# EAGLE design main_board (EAGLE 9.3.0)
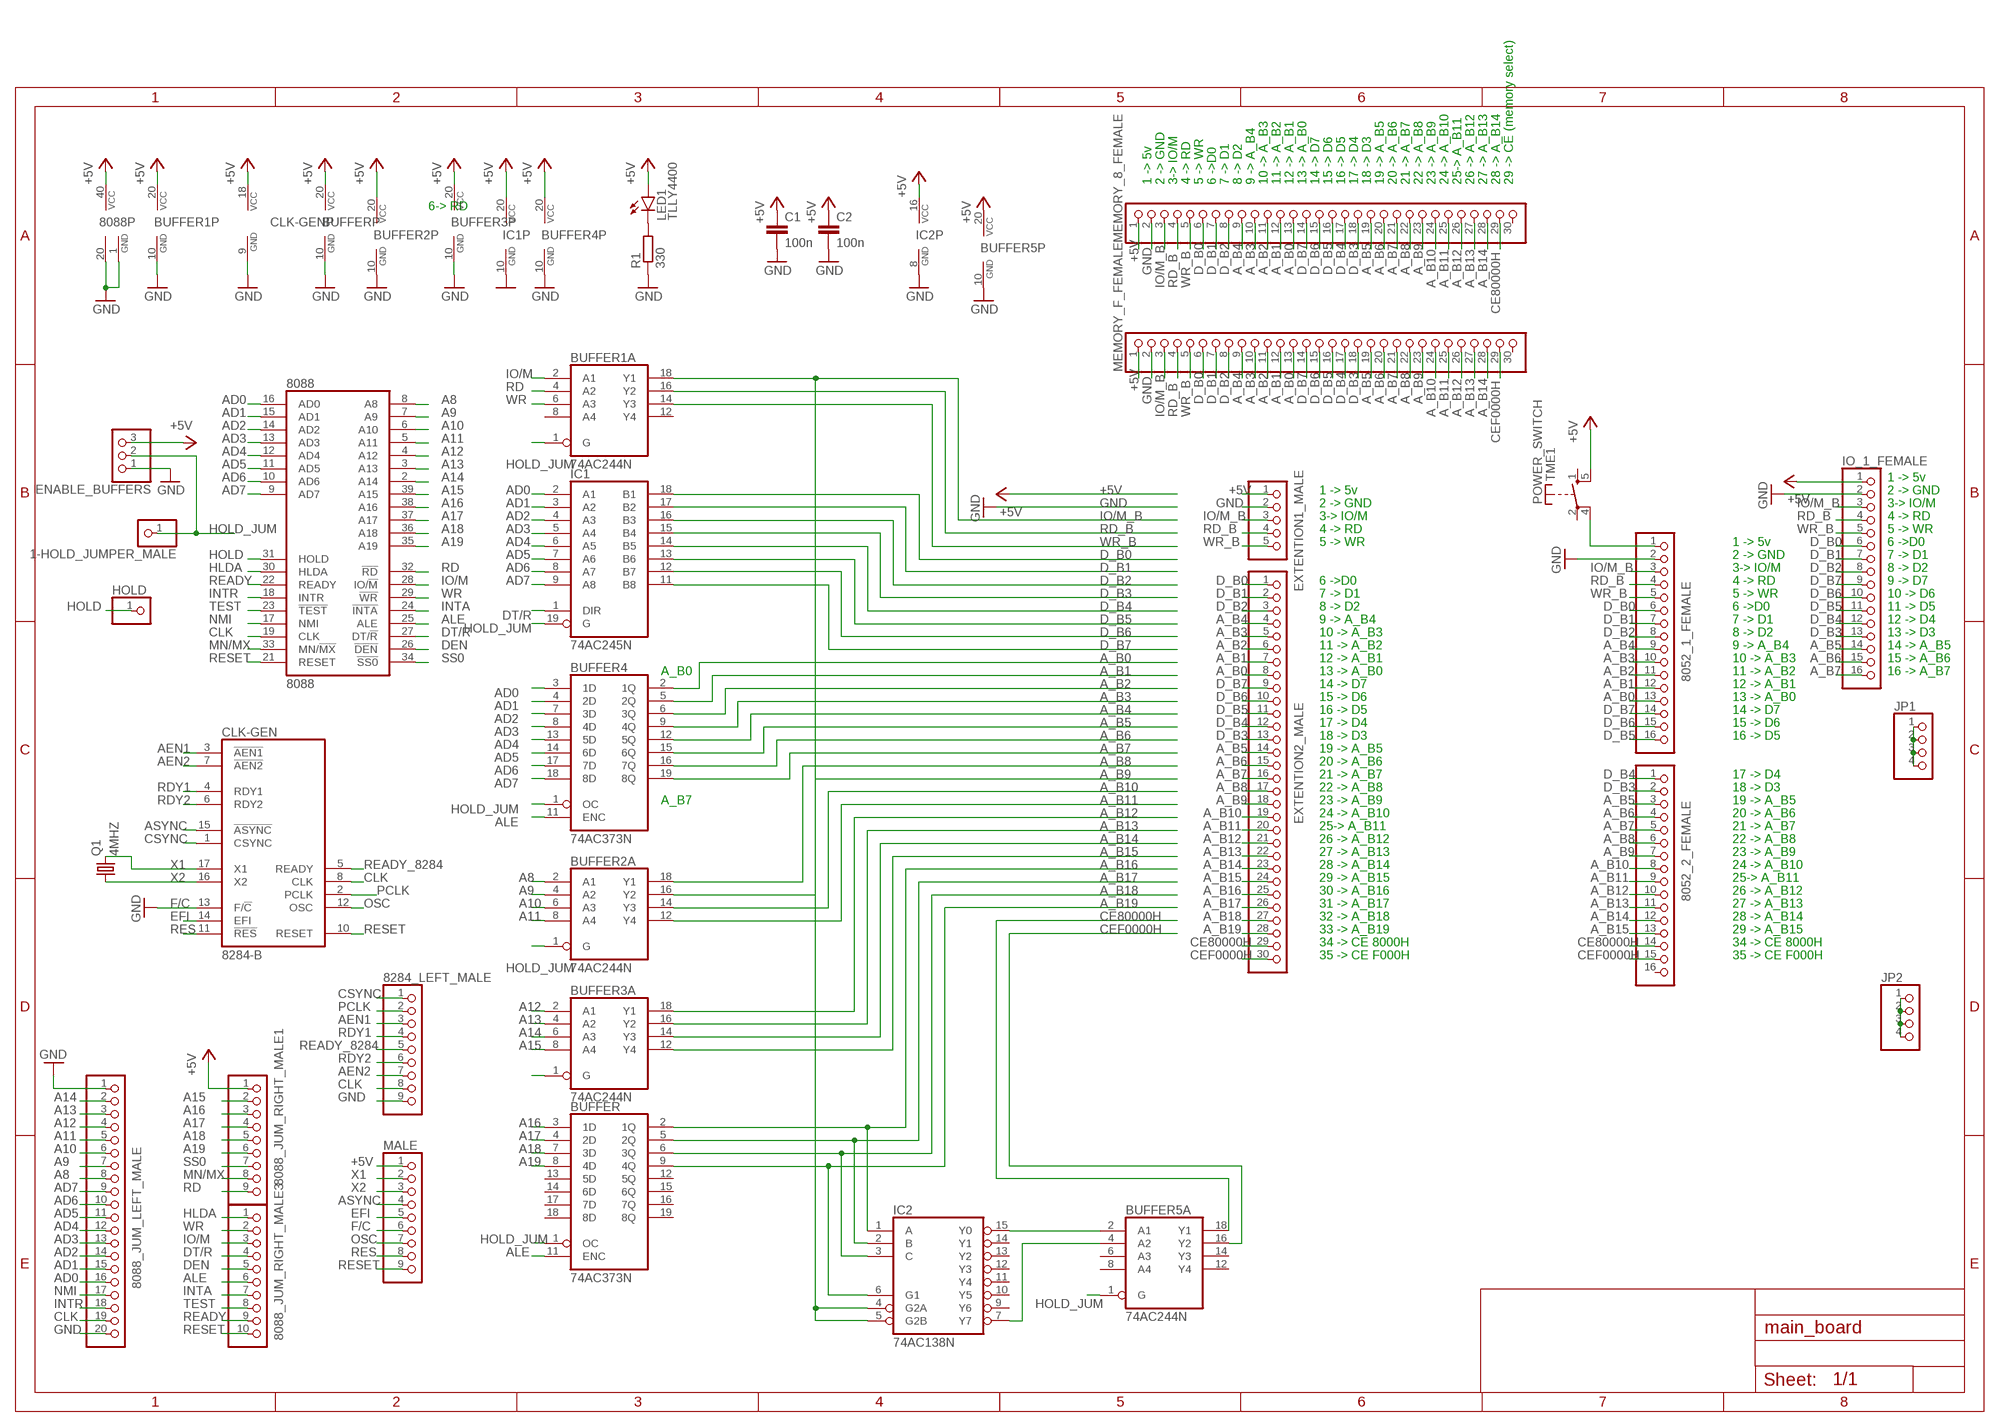
[diagram p0: schematic, sheet 1]

## Parts
1-HOLD_JUMPER_MALE  PINHD-1X1  [1X01]
8052_1_FEMALE  PINHD-1X16  [1X16]
8052_2_FEMALE  PINHD-1X16  [1X16]
8088  8088  [DIL40]
8088_JUM_LEFT_MALE  PINHD-1X20  [1X20]
8088_JUM_RIGHT_MALE1  PINHD-1X9  [1X09]
8088_JUM_RIGHT_MALE3  PINHD-1X10  [1X10]
8284_LEFT_MALE  PINHD-1X9  [1X09]
BUFFER  74AC373N  [DIL20]
BUFFER1  74AC244N  [DIL20]
BUFFER2  74AC244N  [DIL20]
BUFFER3  74AC244N  [DIL20]
BUFFER4  74AC373N  [DIL20]
BUFFER5  74AC244N  [DIL20]
C1  100n  C-EU025-025X050  [C025-025X050]
C2  100n  C-EU025-025X050  [C025-025X050]
CLK-GEN  8284-B  [DIL18]
ENABLE_BUFFERS  PINHD-1X3  [1X03]
EXTENTION1_MALE  PINHD-1X5  [1X05]
EXTENTION2_MALE  PINHD-1X30  [1X30]
HOLD  PINHD-1X1  [1X01]
IC1  74AC245N  [DIL20]
IC2  74AC138N  [DIL16]
IO_1_FEMALE  PINHD-1X16  [1X16]
JP1  PINHD-1X4  [1X04]
JP2  PINHD-1X4  [1X04]
LED1  TLLY4400  [LED3MM]
MALE  PINHD-1X9  [1X09]
MEMORY_8_FEMALE  PINHD-1X30  [1X30]
MEMORY_F_FEMALE  PINHD-1X30  [1X30]
POWER_SWITCH  TME1  [TME1]
Q1  4MHZ  CRYSTALHC49S  [HC49/S]
R1  330  R-EU_0204/5  [0204/5]

## Nets
+5V: 8088.40(VCC) 8088_JUM_RIGHT_MALE1.1 BUFFER1.20(P:VCC) BUFFER2.20(P:VCC) BUFFER3.20(P:VCC) BUFFER4.20(VCC) BUFFER5.20(P:VCC) BUFFER.20(VCC) C1.1 C2.1 CLK-GEN.18(VCC) ENABLE_BUFFERS.3 EXTENTION1_MALE.1 IC1.20(VCC) IC2.16(VCC) IO_1_FEMALE.1 LED1.A MALE.1 MEMORY_8_FEMALE.1 MEMORY_F_FEMALE.1 POWER_SWITCH.5(S)
A8: 8088.8(A8) 8088_JUM_LEFT_MALE.8 BUFFER2.2(A:A1)
A9: 8088.7(A9) 8088_JUM_LEFT_MALE.7 BUFFER2.4(A:A2)
A10: 8088.6(A10) 8088_JUM_LEFT_MALE.6 BUFFER2.6(A:A3)
A11: 8088.5(A11) 8088_JUM_LEFT_MALE.5 BUFFER2.8(A:A4)
A12: 8088.4(A12) 8088_JUM_LEFT_MALE.4 BUFFER3.2(A:A1)
A13: 8088.3(A13) 8088_JUM_LEFT_MALE.3 BUFFER3.4(A:A2)
A14: 8088.2(A14) 8088_JUM_LEFT_MALE.2 BUFFER3.6(A:A3)
A15: 8088.39(A15) 8088_JUM_RIGHT_MALE1.2 BUFFER3.8(A:A4)
A16: 8088.38(A16) 8088_JUM_RIGHT_MALE1.3 BUFFER.3(1D)
A17: 8088.37(A17) 8088_JUM_RIGHT_MALE1.4 BUFFER.4(2D)
A18: 8088.36(A18) 8088_JUM_RIGHT_MALE1.5 BUFFER.7(3D)
A19: 8088.35(A19) 8088_JUM_RIGHT_MALE1.6 BUFFER.8(4D)
A_B0: 8052_1_FEMALE.13 BUFFER4.2(1Q) EXTENTION2_MALE.8 MEMORY_8_FEMALE.13 MEMORY_F_FEMALE.13
A_B1: 8052_1_FEMALE.12 BUFFER4.5(2Q) EXTENTION2_MALE.7 MEMORY_8_FEMALE.12 MEMORY_F_FEMALE.12
A_B2: 8052_1_FEMALE.11 BUFFER4.6(3Q) EXTENTION2_MALE.6 MEMORY_8_FEMALE.11 MEMORY_F_FEMALE.11
A_B3: 8052_1_FEMALE.10 BUFFER4.9(4Q) EXTENTION2_MALE.5 MEMORY_8_FEMALE.10 MEMORY_F_FEMALE.10
A_B4: 8052_1_FEMALE.9 BUFFER4.12(5Q) EXTENTION2_MALE.4 MEMORY_8_FEMALE.9 MEMORY_F_FEMALE.9
A_B5: 8052_2_FEMALE.3 BUFFER4.15(6Q) EXTENTION2_MALE.14 IO_1_FEMALE.14 MEMORY_8_FEMALE.19 MEMORY_F_FEMALE.19
A_B6: 8052_2_FEMALE.4 BUFFER4.16(7Q) EXTENTION2_MALE.15 IO_1_FEMALE.15 MEMORY_8_FEMALE.20 MEMORY_F_FEMALE.20
A_B7: 8052_2_FEMALE.5 BUFFER4.19(8Q) EXTENTION2_MALE.16 IO_1_FEMALE.16 MEMORY_8_FEMALE.21 MEMORY_F_FEMALE.21
A_B8: 8052_2_FEMALE.6 BUFFER2.18(A:Y1) EXTENTION2_MALE.17 MEMORY_8_FEMALE.22 MEMORY_F_FEMALE.22
A_B9: 8052_2_FEMALE.7 BUFFER2.16(A:Y2) EXTENTION2_MALE.18 MEMORY_8_FEMALE.23 MEMORY_F_FEMALE.23
A_B10: 8052_2_FEMALE.8 BUFFER2.14(A:Y3) EXTENTION2_MALE.19 MEMORY_8_FEMALE.24 MEMORY_F_FEMALE.24
A_B11: 8052_2_FEMALE.9 BUFFER2.12(A:Y4) EXTENTION2_MALE.20 MEMORY_8_FEMALE.25 MEMORY_F_FEMALE.25
A_B12: 8052_2_FEMALE.10 BUFFER3.18(A:Y1) EXTENTION2_MALE.21 MEMORY_8_FEMALE.26 MEMORY_F_FEMALE.26
A_B13: 8052_2_FEMALE.11 BUFFER3.16(A:Y2) EXTENTION2_MALE.22 MEMORY_8_FEMALE.27 MEMORY_F_FEMALE.27
A_B14: 8052_2_FEMALE.12 BUFFER3.14(A:Y3) EXTENTION2_MALE.23 MEMORY_8_FEMALE.28 MEMORY_F_FEMALE.28
A_B15: 8052_2_FEMALE.13 BUFFER3.12(A:Y4) EXTENTION2_MALE.24
A_B16: BUFFER.2(1Q) EXTENTION2_MALE.25 IC2.1(A)
A_B17: BUFFER.5(2Q) EXTENTION2_MALE.26 IC2.2(B)
A_B18: BUFFER.6(3Q) EXTENTION2_MALE.27 IC2.3(C)
A_B19: BUFFER.9(4Q) EXTENTION2_MALE.28 IC2.6(G1)
AD0: 8088.16(AD0) 8088_JUM_LEFT_MALE.16 BUFFER4.3(1D) IC1.2(A1)
AD1: 8088.15(AD1) 8088_JUM_LEFT_MALE.15 BUFFER4.4(2D) IC1.3(A2)
AD2: 8088.14(AD2) 8088_JUM_LEFT_MALE.14 BUFFER4.7(3D) IC1.4(A3)
AD3: 8088.13(AD3) 8088_JUM_LEFT_MALE.13 BUFFER4.8(4D) IC1.5(A4)
AD4: 8088.12(AD4) 8088_JUM_LEFT_MALE.12 BUFFER4.13(5D) IC1.6(A5)
AD5: 8088.11(AD5) 8088_JUM_LEFT_MALE.11 BUFFER4.14(6D) IC1.7(A6)
AD6: 8088.10(AD6) 8088_JUM_LEFT_MALE.10 BUFFER4.17(7D) IC1.8(A7)
AD7: 8088.9(AD7) 8088_JUM_LEFT_MALE.9 BUFFER4.18(8D) IC1.9(A8)
AEN1: 8284_LEFT_MALE.3 CLK-GEN.3(!AEN1)
AEN2: 8284_LEFT_MALE.7 CLK-GEN.7(!AEN2)
ALE: 8088.25(ALE) 8088_JUM_RIGHT_MALE3.6 BUFFER4.11(ENC) BUFFER.11(ENC)
ASYNC: CLK-GEN.15(!ASYNC) MALE.4
CE80000H: 8052_2_FEMALE.14 BUFFER5.18(A:Y1) EXTENTION2_MALE.29 MEMORY_8_FEMALE.29
CEF0000H: 8052_2_FEMALE.15 BUFFER5.16(A:Y2) EXTENTION2_MALE.30 MEMORY_F_FEMALE.29
CLK: 8088.19(CLK) 8088_JUM_LEFT_MALE.19 8284_LEFT_MALE.8 CLK-GEN.8(CLK)
CSYNC: 8284_LEFT_MALE.1 CLK-GEN.1(CSYNC)
D_B0: 8052_1_FEMALE.6 EXTENTION2_MALE.1 IC1.18(B1) IO_1_FEMALE.6 MEMORY_8_FEMALE.6 MEMORY_F_FEMALE.6
D_B1: 8052_1_FEMALE.7 EXTENTION2_MALE.2 IC1.17(B2) IO_1_FEMALE.7 MEMORY_8_FEMALE.7 MEMORY_F_FEMALE.7
D_B2: 8052_1_FEMALE.8 EXTENTION2_MALE.3 IC1.16(B3) IO_1_FEMALE.8 MEMORY_8_FEMALE.8 MEMORY_F_FEMALE.8
D_B3: 8052_2_FEMALE.2 EXTENTION2_MALE.13 IC1.15(B4) IO_1_FEMALE.13 MEMORY_8_FEMALE.18 MEMORY_F_FEMALE.18
D_B4: 8052_2_FEMALE.1 EXTENTION2_MALE.12 IC1.14(B5) IO_1_FEMALE.12 MEMORY_8_FEMALE.17 MEMORY_F_FEMALE.17
D_B5: 8052_1_FEMALE.16 EXTENTION2_MALE.11 IC1.13(B6) IO_1_FEMALE.11 MEMORY_8_FEMALE.16 MEMORY_F_FEMALE.16
D_B6: 8052_1_FEMALE.15 EXTENTION2_MALE.10 IC1.12(B7) IO_1_FEMALE.10 MEMORY_8_FEMALE.15 MEMORY_F_FEMALE.15
D_B7: 8052_1_FEMALE.14 EXTENTION2_MALE.9 IC1.11(B8) IO_1_FEMALE.9 MEMORY_8_FEMALE.14 MEMORY_F_FEMALE.14
DEN: 8088.26(!DEN) 8088_JUM_RIGHT_MALE3.5
DT/R: 8088.27(DT/!R) 8088_JUM_RIGHT_MALE3.4 IC1.1(DIR)
EFI: CLK-GEN.14(EFI) MALE.5
F/C: CLK-GEN.13(F/!C) MALE.6 ; supply symbol labelled GND
GND: 8052_1_FEMALE.2 8088.1(GND) 8088.20(GND) 8088_JUM_LEFT_MALE.1 8088_JUM_LEFT_MALE.20 8284_LEFT_MALE.9 BUFFER1.10(P:GND) BUFFER2.10(P:GND) BUFFER3.10(P:GND) BUFFER4.10(GND) BUFFER5.10(P:GND) BUFFER.10(GND) C1.2 C2.2 CLK-GEN.9(GND) ENABLE_BUFFERS.1 EXTENTION1_MALE.2 IC1.10(GND) IC2.8(GND) IO_1_FEMALE.2 MEMORY_8_FEMALE.2 MEMORY_F_FEMALE.2 R1.1
HLDA: 8088.30(HLDA) 8088_JUM_RIGHT_MALE3.1
HOLD: 8088.31(HOLD) HOLD.1
HOLD_JUM: 1-HOLD_JUMPER_MALE.1 BUFFER1.1(A:G) BUFFER2.1(A:G) BUFFER4.1(OC) BUFFER5.1(A:G) BUFFER.1(OC) ENABLE_BUFFERS.2 IC1.19(G)
INTA: 8088.24(!INTA) 8088_JUM_RIGHT_MALE3.7
INTR: 8088.18(INTR) 8088_JUM_LEFT_MALE.18
IO/M: 8088.28(IO/!M) 8088_JUM_RIGHT_MALE3.3 BUFFER1.2(A:A1)
IO/M_B: 8052_1_FEMALE.3 BUFFER1.18(A:Y1) EXTENTION1_MALE.3 IC2.4(G2A) IC2.5(G2B) IO_1_FEMALE.3 MEMORY_8_FEMALE.3 MEMORY_F_FEMALE.3
MN/MX: 8088.33(MN/!MX) 8088_JUM_RIGHT_MALE1.8
N$1: JP1.1 JP1.2 JP1.3 JP1.4
N$2: JP2.1 JP2.2 JP2.3 JP2.4
N$3: LED1.K(C) R1.2
N$4: 8052_1_FEMALE.1 POWER_SWITCH.4(P)
N$5: BUFFER5.2(A:A1) IC2.15(Y0)
N$6: BUFFER5.4(A:A2) IC2.7(Y7)
N$7: BUFFER3.1(A:G)
NMI: 8088.17(NMI) 8088_JUM_LEFT_MALE.17
OSC: CLK-GEN.12(OSC) MALE.7
PCLK: 8284_LEFT_MALE.2 CLK-GEN.2(PCLK)
RD: 8088.32(!RD) 8088_JUM_RIGHT_MALE1.9 BUFFER1.4(A:A2)
RD_B: 8052_1_FEMALE.4 BUFFER1.16(A:Y2) EXTENTION1_MALE.4 IO_1_FEMALE.4 MEMORY_8_FEMALE.4 MEMORY_F_FEMALE.4
RDY1: 8284_LEFT_MALE.4 CLK-GEN.4(RDY1)
RDY2: 8284_LEFT_MALE.6 CLK-GEN.6(RDY2)
READY: 8088.22(READY) 8088_JUM_RIGHT_MALE3.9
READY_8284: 8284_LEFT_MALE.5 CLK-GEN.5(READY)
RES: CLK-GEN.11(!RES) MALE.8
RESET: 8088.21(RESET) 8088_JUM_RIGHT_MALE3.10 CLK-GEN.10(RESET) MALE.9
SS0: 8088.34(!SS0) 8088_JUM_RIGHT_MALE1.7
TEST: 8088.23(!TEST) 8088_JUM_RIGHT_MALE3.8
WR: 8088.29(!WR) 8088_JUM_RIGHT_MALE3.2 BUFFER1.6(A:A3)
WR_B: 8052_1_FEMALE.5 BUFFER1.14(A:Y3) EXTENTION1_MALE.5 IO_1_FEMALE.5 MEMORY_8_FEMALE.5 MEMORY_F_FEMALE.5
X1: CLK-GEN.17(X1) MALE.2 Q1.2
X2: CLK-GEN.16(X2) MALE.3 Q1.1
Unconnected: 8052_2_FEMALE.16 BUFFER1.3(B:Y4) BUFFER1.5(B:Y3) BUFFER1.7(B:Y2) BUFFER1.8(A:A4) BUFFER1.9(B:Y1) BUFFER1.11(B:A1) BUFFER1.12(A:Y4) BUFFER1.13(B:A2) BUFFER1.15(B:A3) BUFFER1.17(B:A4) BUFFER1.19(B:G) BUFFER2.3(B:Y4) BUFFER2.5(B:Y3) BUFFER2.7(B:Y2) BUFFER2.9(B:Y1) BUFFER2.11(B:A1) BUFFER2.13(B:A2) BUFFER2.15(B:A3) BUFFER2.17(B:A4) BUFFER2.19(B:G) BUFFER3.3(B:Y4) BUFFER3.5(B:Y3) BUFFER3.7(B:Y2) BUFFER3.9(B:Y1) BUFFER3.11(B:A1) BUFFER3.13(B:A2) BUFFER3.15(B:A3) BUFFER3.17(B:A4) BUFFER3.19(B:G) BUFFER5.3(B:Y4) BUFFER5.5(B:Y3) BUFFER5.6(A:A3) BUFFER5.7(B:Y2) BUFFER5.8(A:A4) BUFFER5.9(B:Y1) BUFFER5.11(B:A1) BUFFER5.12(A:Y4) BUFFER5.13(B:A2) BUFFER5.14(A:Y3) BUFFER5.15(B:A3) BUFFER5.17(B:A4) BUFFER5.19(B:G) BUFFER.12(5Q) BUFFER.13(5D) BUFFER.14(6D) BUFFER.15(6Q) BUFFER.16(7Q) BUFFER.17(7D) BUFFER.18(8D) BUFFER.19(8Q) IC2.9(Y6) IC2.10(Y5) IC2.11(Y4) IC2.12(Y3) IC2.13(Y2) IC2.14(Y1) MEMORY_8_FEMALE.30 MEMORY_F_FEMALE.30 POWER_SWITCH.1(S) POWER_SWITCH.2(P)

## Notes on the sheet
- 1 -> 5v | 2 -> GND | 3-> IO/M | 4 -> RD | 5 -> WR | 6 ->D0 | 7 -> D1 | 8 -> D2 | 9 -> A_B4 | 10 -> A_B3 | 11 -> A_B2 | 12 -> A_B1 | 13 -> A_B0 | 14 -> D7 | 15 -> D6 | 16 -> D5 | 17 -> D4 | 18 -> D3 | 19 -> A_B5 | 20 -> A_B6 | 21 -> A_B7 | 22 -> A_B8 | 23 -> A_B9 | 24 -> A_B10 | 25-> A_B11 | 26 -> A_B12 | 27 -> A_B13 | 28 -> A_B14 | 29 -> CE (memory select)
- 6-> RD
- 1 -> 5v
- 1 -> 5v | 2 -> GND
- 2 -> GND | 3-> IO/M
- 3-> IO/M | 4 -> RD
- 4 -> RD | 5 -> WR
- 5 -> WR | 1 -> 5v | 6 ->D0
- 2 -> GND | 7 -> D1
- 3-> IO/M | 8 -> D2
- 6 ->D0 | 4 -> RD | 9 -> D7
- 7 -> D1 | 5 -> WR | 10 -> D6
- 8 -> D2 | 6 ->D0 | 11 -> D5
- 9 -> A_B4 | 7 -> D1 | 12 -> D4
- 10 -> A_B3 | 8 -> D2 | 13 -> D3
- 11 -> A_B2 | 9 -> A_B4 | 14 -> A_B5
- 12 -> A_B1 | 10 -> A_B3 | 15 -> A_B6
- A_B0 | 13 -> A_B0 | 11 -> A_B2 | 16 -> A_B7
- 14 -> D7 | 12 -> A_B1
- 15 -> D6 | 13 -> A_B0
- 16 -> D5 | 14 -> D7
- 17 -> D4 | 15 -> D6
- 18 -> D3 | 16 -> D5
- 19 -> A_B5
- 20 -> A_B6
- 21 -> A_B7 | 17 -> D4
- 22 -> A_B8 | 18 -> D3
- A_B7 | 23 -> A_B9 | 19 -> A_B5
- 24 -> A_B10 | 20 -> A_B6
- 25-> A_B11 | 21 -> A_B7
- 26 -> A_B12 | 22 -> A_B8
- 27 -> A_B13 | 23 -> A_B9
- 28 -> A_B14 | 24 -> A_B10
- 29 -> A_B15 | 25-> A_B11
- 30 -> A_B16 | 26 -> A_B12
- 31 -> A_B17 | 27 -> A_B13
- 32 -> A_B18 | 28 -> A_B14
- 33 -> A_B19 | 29 -> A_B15
- 34 -> CE 8000H | 34 -> CE 8000H
- 35 -> CE F000H | 35 -> CE F000H

## Library data of the parts
1-HOLD_JUMPER_MALE HOLD = pinhead:PINHD-1X1: PIN HEADER
8052_1_FEMALE 8052_2_FEMALE IO_1_FEMALE = pinhead:PINHD-1X16: PIN HEADER
8088 = micro-siemens:8088: MICROPROCESSOR/PERIPHERAL DEVICE; OC_FARNELL: unknown; OC_NEWARK: unknown
8088_JUM_LEFT_MALE = pinhead:PINHD-1X20: PIN HEADER
8088_JUM_RIGHT_MALE1 8284_LEFT_MALE MALE = pinhead:PINHD-1X9: PIN HEADER
8088_JUM_RIGHT_MALE3 = pinhead:PINHD-1X10: PIN HEADER
BUFFER BUFFER4 = 74xx-eu:74*373: Octal D type transparent LATCH, edge triggered
BUFFER1-BUFFER3 BUFFER5 = 74xx-eu:74*244: Octal BUFFER and LINE DRIVER, 3-state
C1 C2 = rcl:C-EU: CAPACITOR, European symbol; SPICEPREFIX: C
CLK-GEN = micro-siemens:8284-B: MICROPROCESSOR/PERIPHERAL DEVICE; OC_FARNELL: unknown; OC_NEWARK: unknown
ENABLE_BUFFERS = pinhead:PINHD-1X3: PIN HEADER
EXTENTION1_MALE = pinhead:PINHD-1X5: PIN HEADER
EXTENTION2_MALE MEMORY_8_FEMALE MEMORY_F_FEMALE = pinhead:PINHD-1X30: PIN HEADER
IC1 = 74xx-eu:74*245: Octal BUS TRANSCEIVER, 3-state
IC2 = 74xx-eu:74*138: 3-line to 8-line DECODER/DEMULTIPLEXER
JP1 JP2 = pinhead:PINHD-1X4: PIN HEADER
LED1 = led:TLLY4400: Low Current (2mA) LED 3 mm Tinted Diffused Package color YELLOW Source: Data sheet <http://www.farnell.com/datasheets/391098.pdf>; MF: VISHAY SEMICONDUCTOR; OC_FARNELL: 1612439
POWER_SWITCH = switch-misc:TME1: SWITCH
Q1 = crystal:CRYSTAL: CRYSTAL; OC_FARNELL: 1667008; OC_NEWARK: unknown
R1 = rcl:R-EU_: RESISTOR, European symbol; SPICEPREFIX: R

## Net classes
0 default: width 0.6 mm, drill 0.6 mm, clearance 0.5 mm

## Board
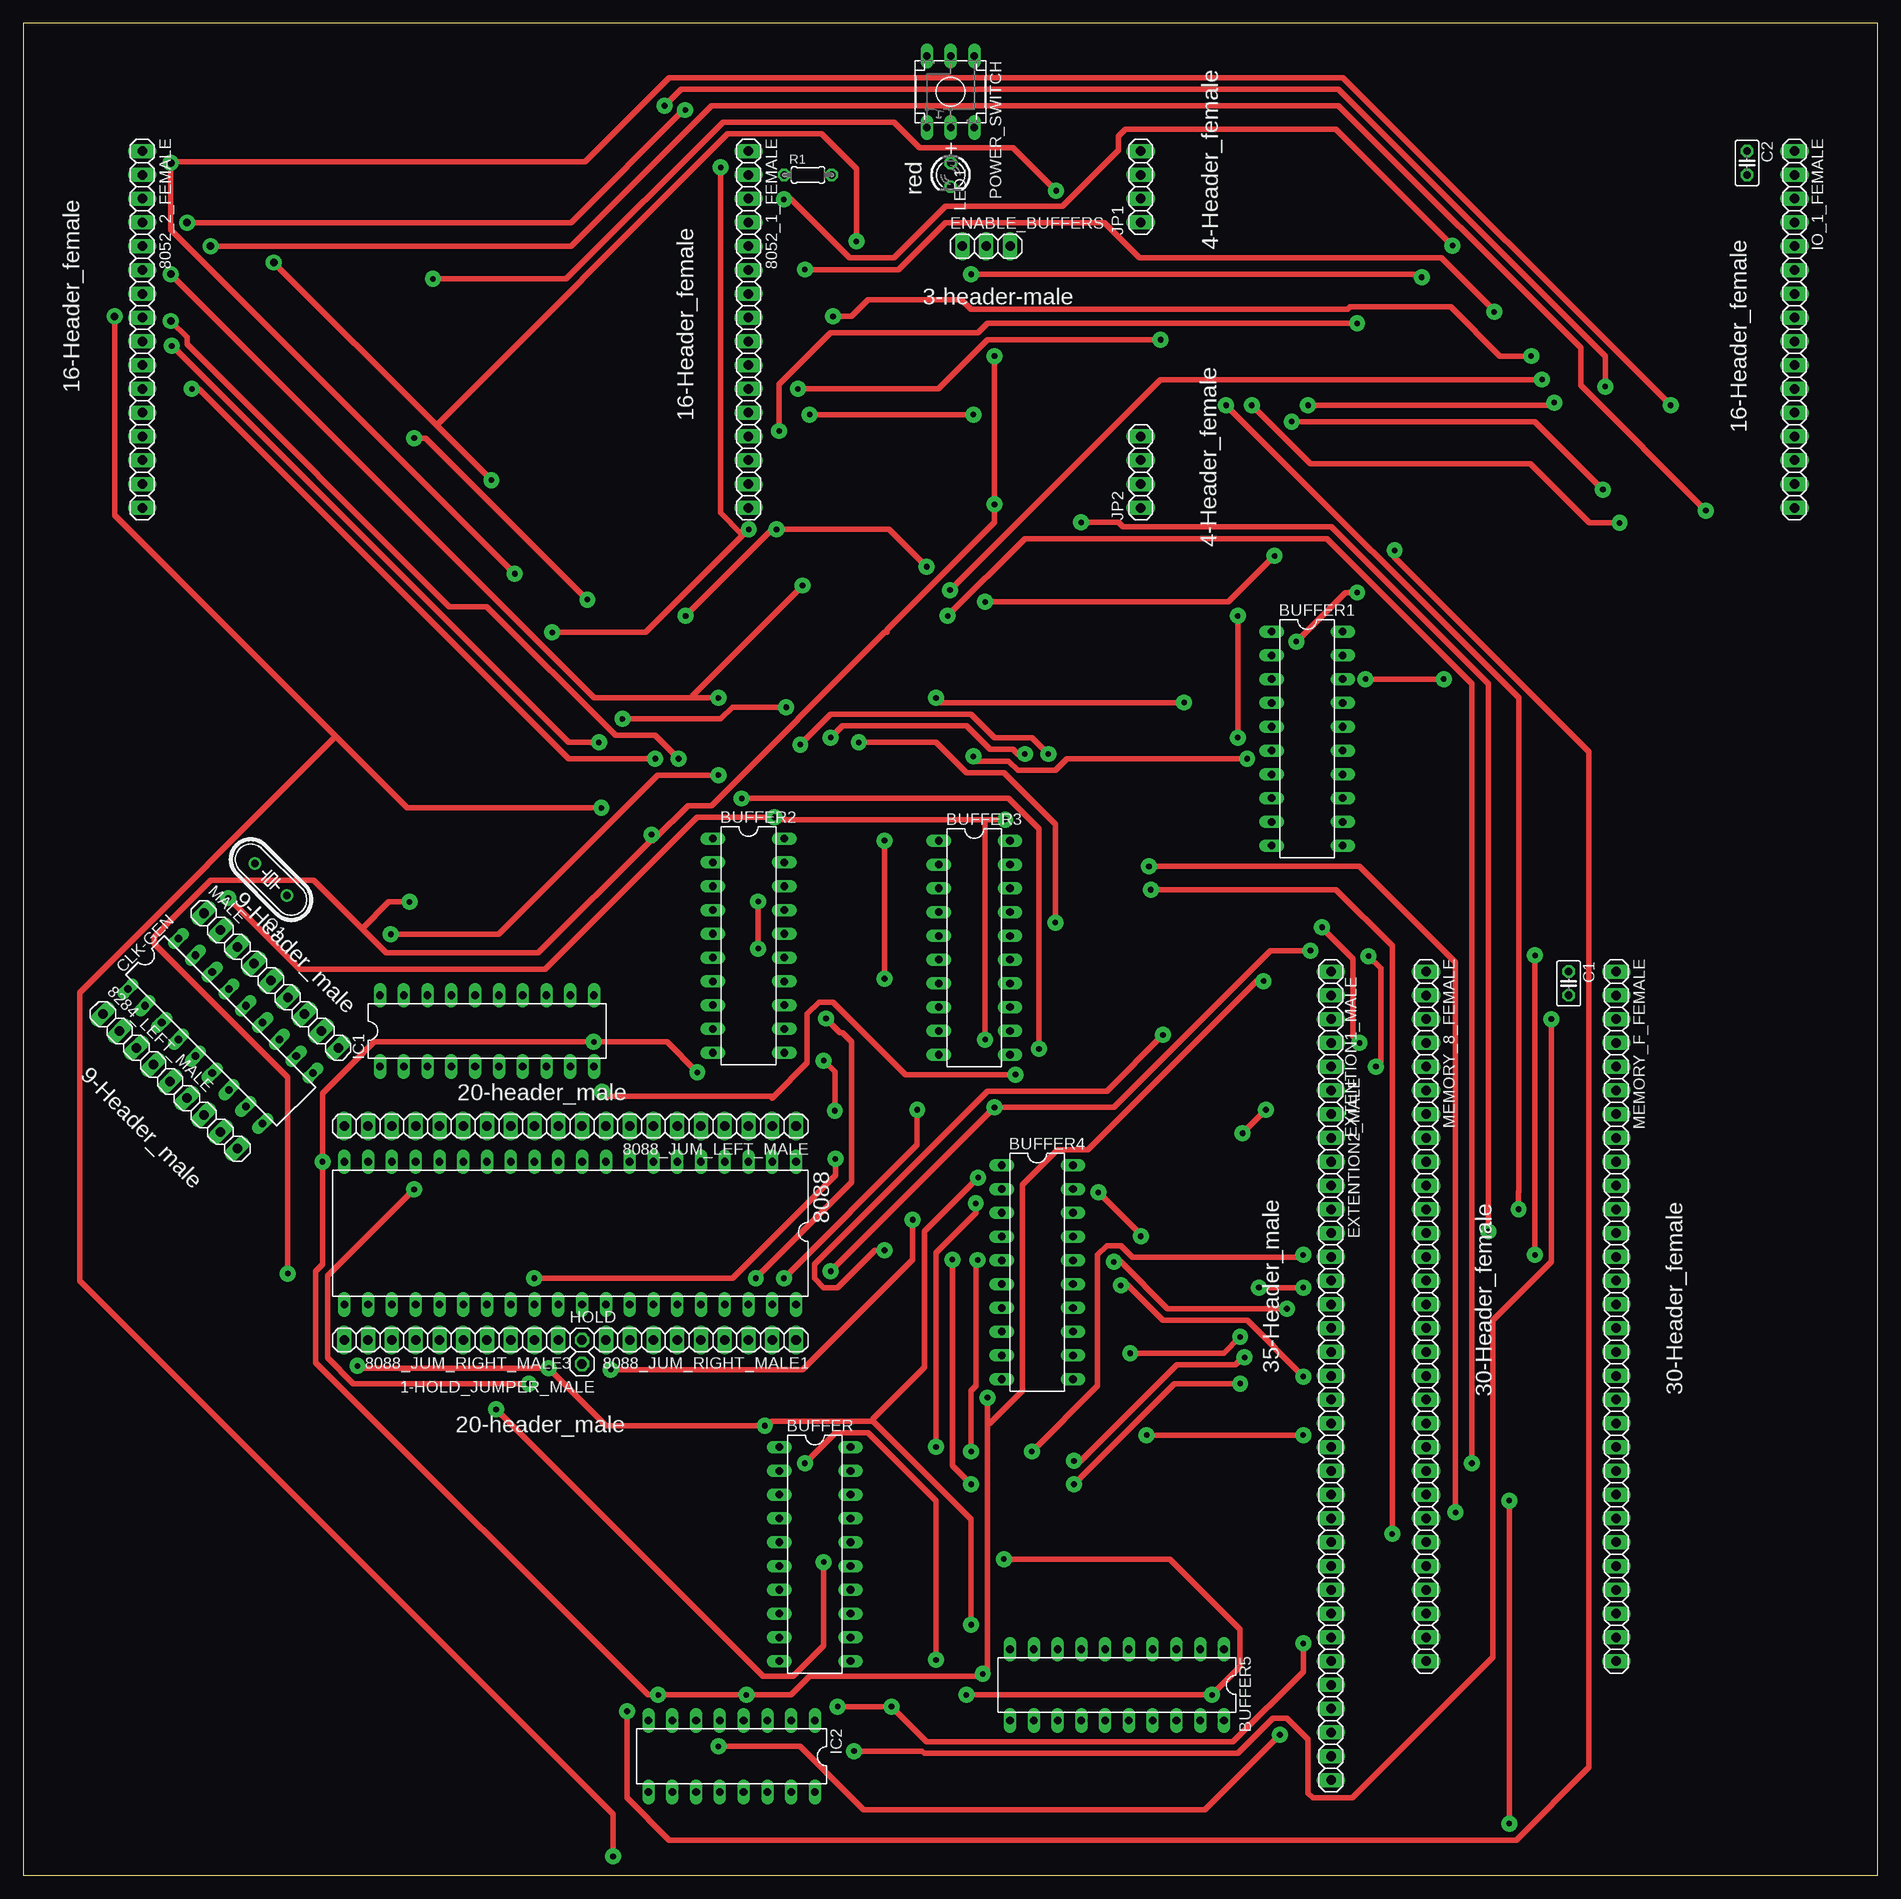
[diagram p1: board, top side]
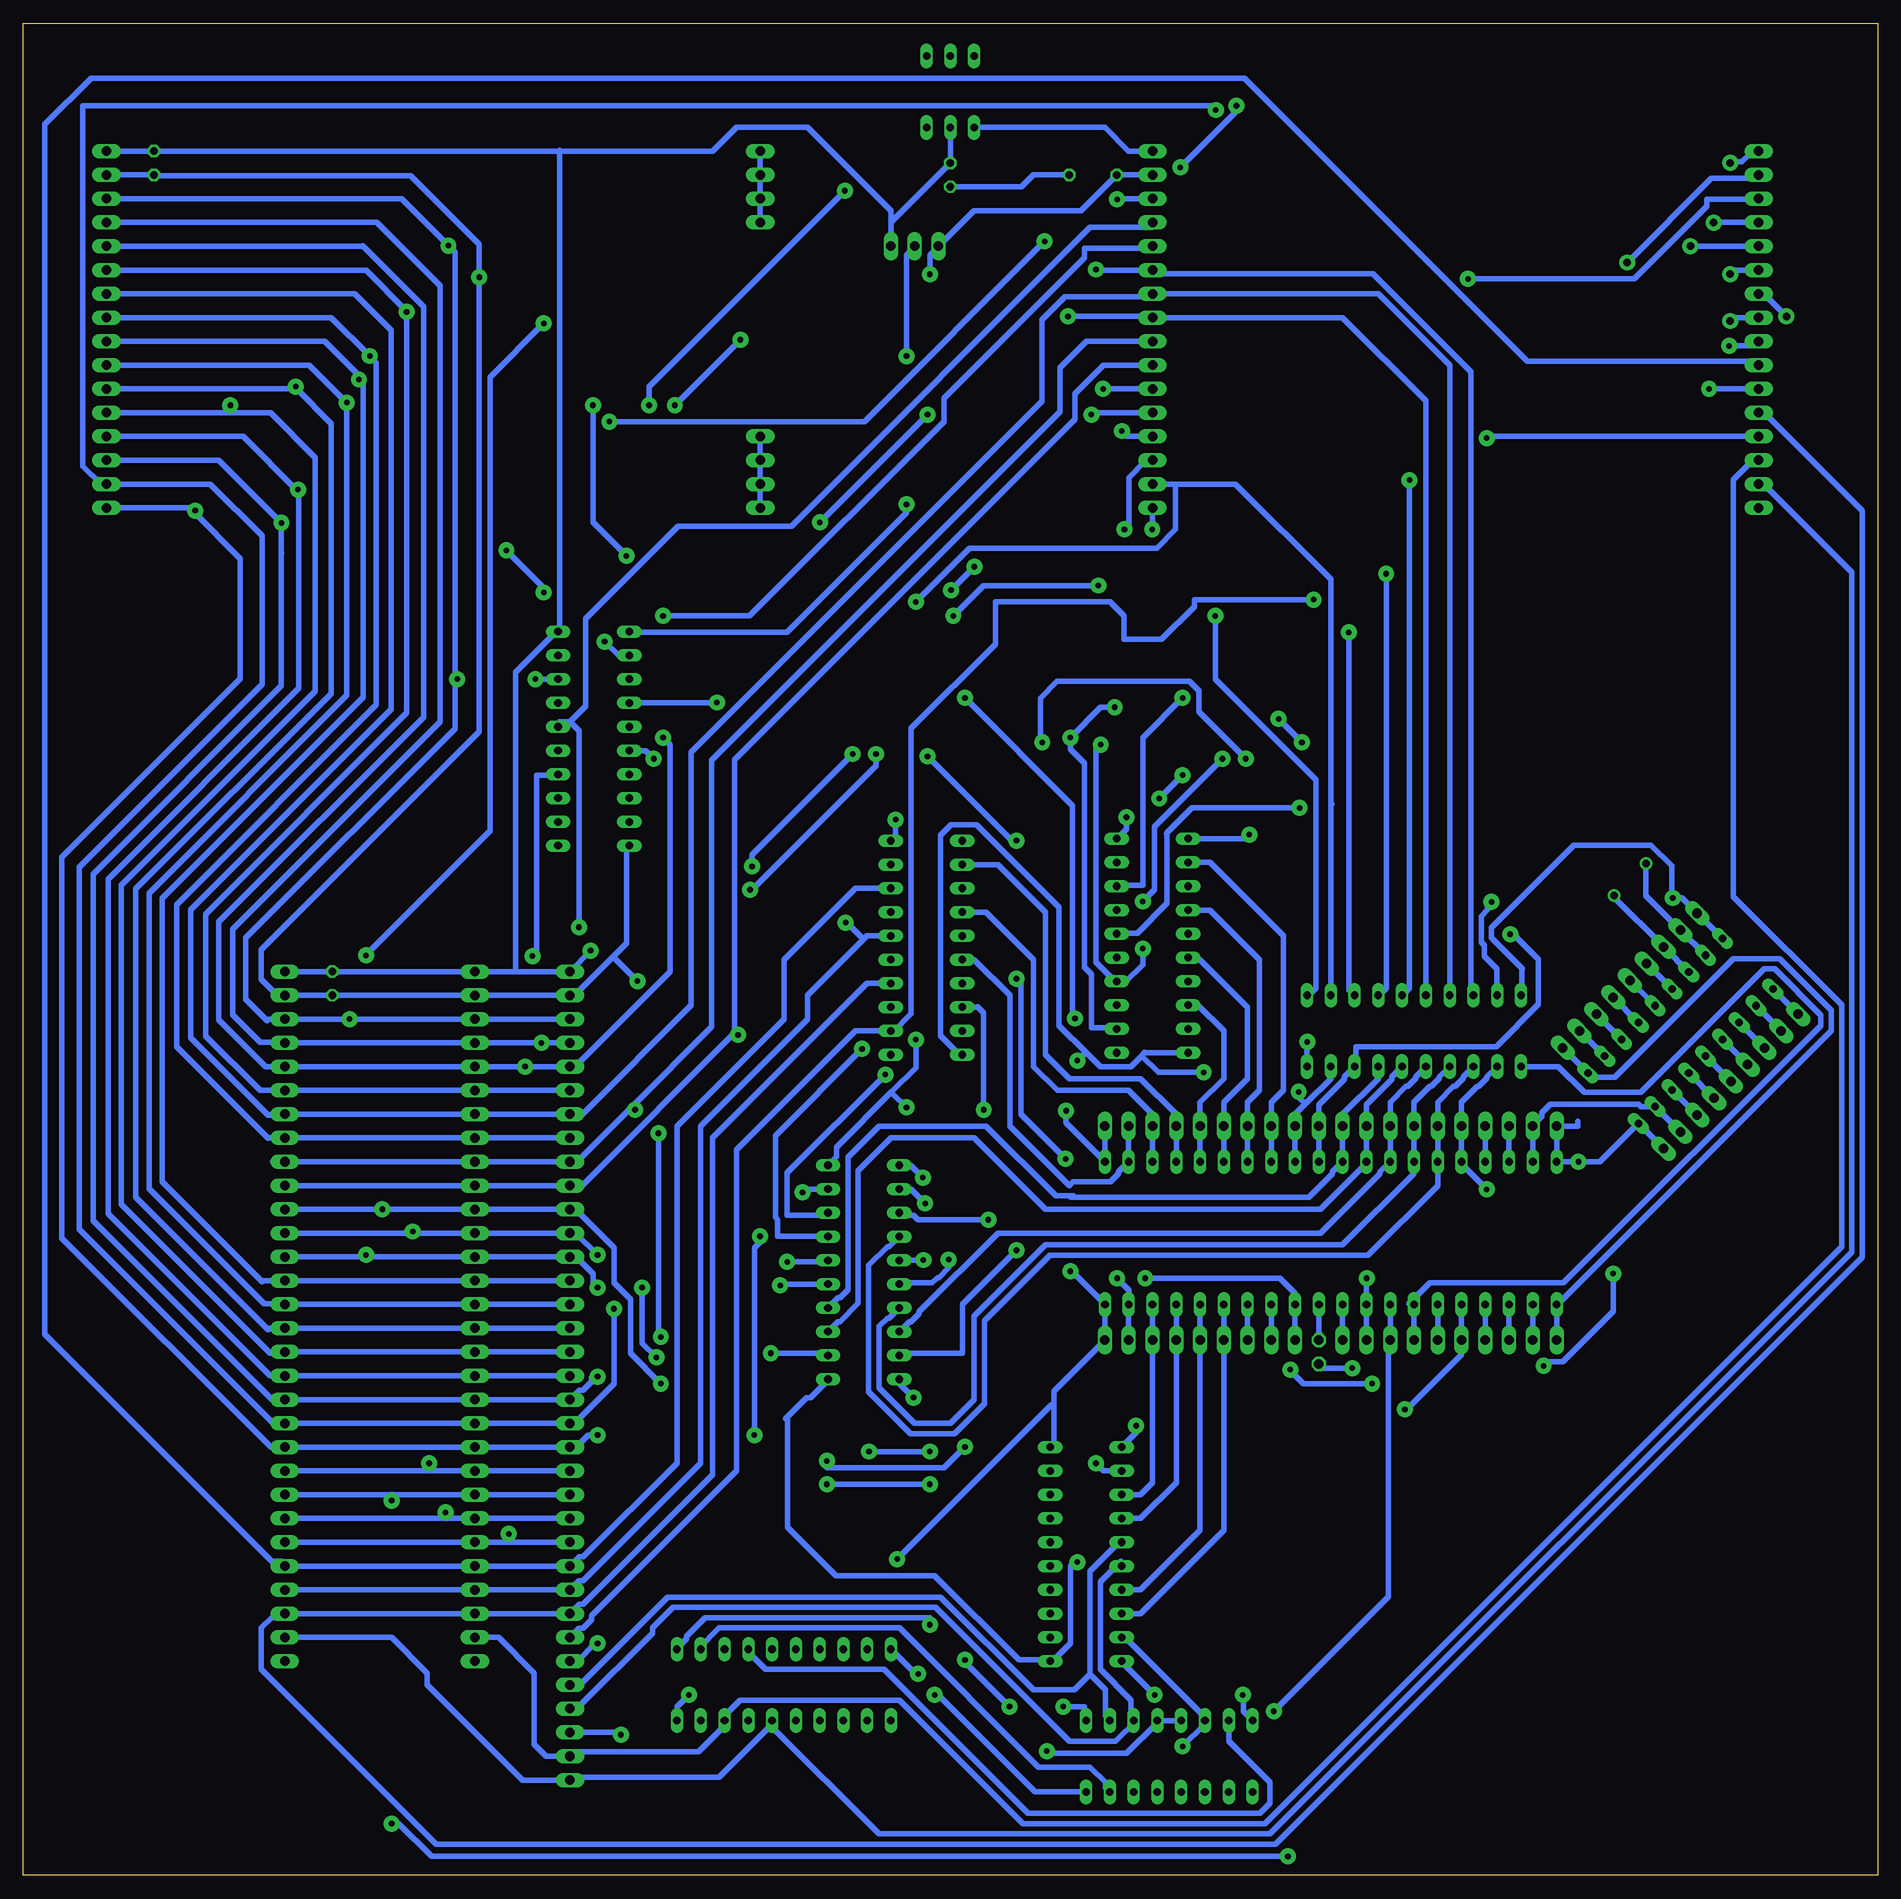
[diagram p2: board, bottom side, seen from below]

Size 198.1 x 197.79 mm. Coordinates in mm from the lower left corner, seen from the top.
Outline: 0,0 198.1,0 198.1,197.79 0,197.79 0,0
Copper layers (1*16): Top 0.035mm / dielectric 1.5mm / Bottom 0.035mm
Design rules "default": minimum track width 6mil, minimum drill 0.35mm, track to track 6mil, track to pad 6mil, pad to pad 6mil, via to via 6mil, smd to smd 6mil, copper to edge 40mil, drill to drill 6mil, minimum pad ring 10mil, minimum via ring 8mil, stop-mask expansion 4mil, vias tented up to drill 0mil, thermal gap 10mil
tRestrict: area 10.9,144.8 to 14.6,185.7; area 75.6,144.9 to 79.6,185.6; area 80.3,180 to 82.6,182.7; area 85.5,180.4 to 87.8,182.9; area 95.2,192.6 to 103.2,196.3; area 95.4,185.3 to 103.2,188.4; area 98.1,179.5 to 100.5,183.8; area 98.7,172.4 to 106.9,176.1; area 117.7,175 to 121.3,186; area 117.6,144.5 to 121.2,155; area 187.7,144.3 to 191,185.7; area 182.7,180.7 to 185.7,185.7; 30 more areas

### Footprints (pad centres in the part's own frame; a part is rotated, then mirrored left to right if it is on the bottom)
1X01 = drill 1.016 octagon: 1 0,0
1X16 = drill 1.016 long: 1 -19.05,0; 2 -16.51,0; 3 -13.97,0; 4 -11.43,0; 5 -8.89,0; 6 -6.35,0; 7 -3.81,0; 8 -1.27,0; 9 1.27,0; 10 3.81,0; 11 6.35,0; 12 8.89,0; 13 11.43,0; 14 13.97,0; 15 16.51,0; 16 19.05,0
DIL40 = drill 0.813 long: 1 -24.13,-7.62; 2 -21.59,-7.62; 3 -19.05,-7.62; 4 -16.51,-7.62; 5 -13.97,-7.62; 6 -11.43,-7.62; 7 -8.89,-7.62; 8 -6.35,-7.62; 9 -3.81,-7.62; 10 -1.27,-7.62; 11 1.27,-7.62; 12 3.81,-7.62; 13 6.35,-7.62; 14 8.89,-7.62; 15 11.43,-7.62; 16 13.97,-7.62; 17 16.51,-7.62; 18 19.05,-7.62; 19 21.59,-7.62; 20 24.13,-7.62; 21 24.13,7.62; 22 21.59,7.62; 23 19.05,7.62; 24 16.51,7.62; 25 13.97,7.62; 26 11.43,7.62; 27 8.89,7.62; 28 6.35,7.62; 29 3.81,7.62; 30 1.27,7.62; 31 -1.27,7.62; 32 -3.81,7.62; 33 -6.35,7.62; 34 -8.89,7.62; 35 -11.43,7.62; 36 -13.97,7.62; 37 -16.51,7.62; 38 -19.05,7.62; 39 -21.59,7.62; 40 -24.13,7.62
1X20 = drill 1.016 long: 1 -24.13,0; 2 -21.59,0; 3 -19.05,0; 4 -16.51,0; 5 -13.97,0; 6 -11.43,0; 7 -8.89,0; 8 -6.35,0; 9 -3.81,0; 10 -1.27,0; 11 1.27,0; 12 3.81,0; 13 6.35,0; 14 8.89,0; 15 11.43,0; 16 13.97,0; 17 16.51,0; 18 19.05,0; 19 21.59,0; 20 24.13,0
1X09 = drill 1.016 long: 1 -10.16,0; 2 -7.62,0; 3 -5.08,0; 4 -2.54,0; 5 0,0; 6 2.54,0; 7 5.08,0; 8 7.62,0; 9 10.16,0
1X10 = drill 1.016 long: 1 -11.43,0; 2 -8.89,0; 3 -6.35,0; 4 -3.81,0; 5 -1.27,0; 6 1.27,0; 7 3.81,0; 8 6.35,0; 9 8.89,0; 10 11.43,0
DIL20 = drill 0.813 long: 1 -11.43,-3.81; 2 -8.89,-3.81; 3 -6.35,-3.81; 4 -3.81,-3.81; 5 -1.27,-3.81; 6 1.27,-3.81; 7 3.81,-3.81; 8 6.35,-3.81; 9 8.89,-3.81; 10 11.43,-3.81; 11 11.43,3.81; 12 8.89,3.81; 13 6.35,3.81; 14 3.81,3.81; 15 1.27,3.81; 16 -1.27,3.81; 17 -3.81,3.81; 18 -6.35,3.81; 19 -8.89,3.81; 20 -11.43,3.81
C025-025X050 = drill 0.813 octagon: 1 -1.27,0; 2 1.27,0
DIL18 = drill 0.813 long: 1 -10.16,-3.81; 2 -7.62,-3.81; 3 -5.08,-3.81; 4 -2.54,-3.81; 5 0,-3.81; 6 2.54,-3.81; 7 5.08,-3.81; 8 7.62,-3.81; 9 10.16,-3.81; 10 10.16,3.81; 11 7.62,3.81; 12 5.08,3.81; 13 2.54,3.81; 14 0,3.81; 15 -2.54,3.81; 16 -5.08,3.81; 17 -7.62,3.81; 18 -10.16,3.81
1X03 = drill 1.016 long: 1 -2.54,0; 2 0,0; 3 2.54,0
1X05 = drill 1.016 long: 1 -5.08,0; 2 -2.54,0; 3 0,0; 4 2.54,0; 5 5.08,0
1X30 = drill 1.016 long: 1 -36.83,0; 2 -34.29,0; 3 -31.75,0; 4 -29.21,0; 5 -26.67,0; 6 -24.13,0; 7 -21.59,0; 8 -19.05,0; 9 -16.51,0; 10 -13.97,0; 11 -11.43,0; 12 -8.89,0; 13 -6.35,0; 14 -3.81,0; 15 -1.27,0; 16 1.27,0; 17 3.81,0; 18 6.35,0; 19 8.89,0; 20 11.43,0; 21 13.97,0; 22 16.51,0; 23 19.05,0; 24 21.59,0; 25 24.13,0; 26 26.67,0; 27 29.21,0; 28 31.75,0; 29 34.29,0; 30 36.83,0
DIL16 = drill 0.813 long: 1 -8.89,-3.81; 2 -6.35,-3.81; 3 -3.81,-3.81; 4 -1.27,-3.81; 5 1.27,-3.81; 6 3.81,-3.81; 7 6.35,-3.81; 8 8.89,-3.81; 9 8.89,3.81; 10 6.35,3.81; 11 3.81,3.81; 12 1.27,3.81; 13 -1.27,3.81; 14 -3.81,3.81; 15 -6.35,3.81; 16 -8.89,3.81
1X04 = drill 1.016 long: 1 -3.81,0; 2 -1.27,0; 3 1.27,0; 4 3.81,0
LED3MM = drill 0.813 octagon: A -1.27,0; K 1.27,0
TME1 = drill 0.813 long: 1 -2.54,-3.81; 2 0,-3.81; 3 2.54,-3.81; 4 2.54,3.81; 5 0,3.81; 6 -2.54,3.81
HC49/S = drill 0.813: 1 -2.413,0; 2 2.413,0
0204/5 = drill 0.813 octagon: 1 -2.54,0; 2 2.54,0

### Placement (x,y rotation side)
1-HOLD_JUMPER_MALE  59.69,54.61 180 top
8052_1_FEMALE  77.47,165.1 270 top
8052_2_FEMALE  12.7,165.1 270 top
8088  58.42,68.58 180 top
8088_JUM_LEFT_MALE  58.42,80.01 180 top
8088_JUM_RIGHT_MALE1  72.39,57.15 180 top
8088_JUM_RIGHT_MALE3  45.72,57.15 180 top
8284_LEFT_MALE  15.68,84.78 315 top
BUFFER  84.56,34.29 270 top
BUFFER1  137.16,121.39 270 top
BUFFER2  77.47,99.28 270 top
BUFFER3  101.6,99.06 270 top
BUFFER4  108.32,64.4 270 top
BUFFER5  116.84,20.32 180 top
C1  165.1,95.25 270 top
C2  184.15,182.88 270 top
CLK-GEN  21.06,90.17 315 top
ENABLE_BUFFERS  102.87,173.99 0 top
EXTENTION1_MALE  139.7,91.44 270 top
EXTENTION2_MALE  139.7,46.99 270 top
HOLD  59.69,57.15 0 top
IC1  49.53,90.17 0 top
IC2  75.67,12.7 180 top
IO_1_FEMALE  189.23,165.1 270 top
JP1  119.38,180.34 90 top
JP2  119.38,149.86 90 top
LED1  99.06,181.61 270 top
MALE  26.45,95.56 315 top
MEMORY_8_FEMALE  149.86,59.69 270 top
MEMORY_F_FEMALE  170.18,59.69 270 top
POWER_SWITCH  99.06,190.5 180 top
Q1  26.45,106.33 135 top
R1  83.82,181.61 0 top

### Tracks (layer width: path | path; a pad name or v marks a point on that pad's centre or on a via)
+5V  (via drill 0.6 pad 1.7)
  Top 0.6: v100.75,19.25 v127,19.25 130,22.25 130,26.25 122.5,33.75 v104.75,33.75 | v21.88,104.38 29.5,96.75 55.75,96.75 72,113 v80.25,113 80.25,112.75 102.75,112.75 | 102.75,112.75 v104.9,112.75 105,112.75 | 102.75,112.75 v102.75,89.25 | v86.25,64.5 v103.75,82 116.5,82 133.25,98.75 v137.5,98.75
  Bottom 0.6: MEMORY_F_FEMALE.1 C1.1 MEMORY_8_FEMALE.1 145.5,96.52 | 8088.40 8088_JUM_RIGHT_MALE1.1 88,51.7 88,50.25 | MALE.1 CLK-GEN.18 | POWER_SWITCH.5 LED1.A 105.41,176.53 | 105.41,176.53 ENABLE_BUFFERS.3 | IO_1_FEMALE.1 C2.1 140.8,184.15 | 140.8,184.15 124.46,184.15 121.92,186.69 114.3,186.69 105.41,177.8 105.41,176.53 | 88,50.25 88,46.2 BUFFER.20 | 140.8,184.15 140.8,133.1 BUFFER1.20 141.25,132.75 145.5,128.5 145.5,96.52 | 140.8,184.25 140.8,184.15 | 145.5,96.52 EXTENTION1_MALE.1 | 84.75,9 IC2.16 90.02,8.89 100.38,19.25 v100.75,19.25 | IC1.20 38,94 38,96.75 37.95,96.8 41.25,100.1 41.25,101.2 32.45,110 24.2,110 22,107.8 22,104.5 v21.88,104.38 20.9,104.38 MALE.1 | 19.25,103 MALE.1 | 105,110.75 105.25,110.5 BUFFER3.20 104.9,111 v104.9,112.75 | 105.29,83.71 102.75,86.25 v102.75,89.25 | 105.29,83.71 111.25,77.75 111.25,76.75 112,76 BUFFER4.20 | 82.75,61 8088.40 | 139.5,96.75 EXTENTION1_MALE.1 | v104.75,33.75 88.25,50.25 88,50.25 | 105.29,83.71 105.29,83.54 v103.75,82 | 8088.40 86.09,64.5 v86.25,64.5 | BUFFER2.20 80.25,111.74 v80.25,113 | EXTENTION1_MALE.1 137.5,98.72 v137.5,98.75 | BUFFER5.20 128.27,17.98 v127,19.25
A8
  Bottom 0.6: 8088.8 8088_JUM_LEFT_MALE.8 | 8088_JUM_LEFT_MALE.8 64.77,81.28 | 8088_JUM_LEFT_MALE.8 64.77,82.55 63.5,83.82 63.5,100.33 71.34,108.17 BUFFER2.2
A9
  Bottom 0.6: 8088.7 8088_JUM_LEFT_MALE.7 67.31,82.55 66.04,83.82 66.04,97.79 71.34,103.09 BUFFER2.4
A10
  Bottom 0.6: 8088.6 8088_JUM_LEFT_MALE.6 69.85,82.55 67.31,85.09 67.31,92.71 72.39,97.79 73.66,97.79 BUFFER2.6 | BUFFER2.6
A11
  Bottom 0.6: 8088.5 8088_JUM_LEFT_MALE.5 72.39,82.55 69.85,85.09 69.85,90.17 72.61,92.93 BUFFER2.8
A12
  Bottom 0.6: 8088.4 8088_JUM_LEFT_MALE.4 74.93,81.28 78.74,85.09 86.36,85.09 88.9,87.63 88.9,102.87 93.98,107.95 BUFFER3.2
A13
  Bottom 0.6: 8088.3 8088_JUM_LEFT_MALE.3 77.47,81.28 80.01,83.82 87.63,83.82 90.17,86.36 90.17,97.79 95.25,102.87 BUFFER3.4
A14
  Bottom 0.6: 8088_JUM_LEFT_MALE.2 8088.2 81.09,75.12 81.09,74.94 81.94,74.08 85.94,74.08 86.36,73.66 92.71,80.01 92.71,93.98 96.52,97.79 BUFFER3.6
A15  (via drill 0.6 pad 1.7)
  Top 0.6: v95.5,81.75 95.5,78 v81.25,63.75
  Bottom 0.6: 8088_JUM_RIGHT_MALE1.2 8088.39 80,61.25 80,62.5 v81.25,63.75 | BUFFER3.8 96.96,92.71 96.23,92.71 96.17,92.77 95.5,92.1 v95.5,81.75
A16
  Bottom 0.6: 8088.38 8088_JUM_RIGHT_MALE1.3 77.47,41.91 78.74,40.64 BUFFER.3
A17
  Bottom 0.6: 8088.37 8088_JUM_RIGHT_MALE1.4 74.93,41.91 78.74,38.1 BUFFER.4 | BUFFER.4
A18
  Bottom 0.6: 8088.36 8088_JUM_RIGHT_MALE1.5 72.39,36.83 78.74,30.48 BUFFER.7 | BUFFER.7
A19
  Bottom 0.6: 8088.35 8088_JUM_RIGHT_MALE1.6 69.85,36.83 78.74,27.94 BUFFER.8 | BUFFER.8
A_B0  (via drill 0.6 pad 1.7)
  Top 0.6: v101.75,71.75 101.75,70.75 97.5,66.5 v97.5,45.75 | v112.25,44.25 113,44.25 123.25,54.5 129.5,54.5 130.3,55.3 v130.47,55.3 | v136.75,62.75 v132,62.75 | v80.75,154.25 80.75,159.25 86.25,164.75 102,164.75 103,165.75 v142.5,165.75 | v161.5,66.25 v161.5,98.25
  Bottom 0.6: BUFFER4.2 104.5,73.25 103.25,73.25 v101.75,71.75 | 148.25,111.5 148.25,111.53 | 148.25,111.53 148.25,160 v142.5,165.75 | 77.5,153.75 8052_1_FEMALE.13 80.17,153.67 v80.75,154.25 | v97.5,45.75 99.75,43.5 112.25,43.5 v112.25,44.25 | v130.47,55.3 132,56.83 v132,62.75 | v136.75,62.75 137.25,63.25 137.25,64.25 139,66 139.5,66 EXTENTION2_MALE.8 MEMORY_8_FEMALE.13 161.29,66.04 | 148.25,111.53 161.5,98.28 v161.5,98.25 | 161.29,66.04 v161.5,66.25 | MEMORY_F_FEMALE.13 161.29,66.04
A_B1  (via drill 0.6 pad 1.7)
  Top 0.6: v101.25,45.25 101.25,51.75 101.75,52.25 101.75,65.5 v101.95,65.7 | v107.75,45.25 114.75,52.25 114.75,66.25 115.75,67.25 117.25,67.25 118.5,66 136.5,66 v136.75,66.25 | v101.5,156 v84,156 | v113,144.5 117,144.5 117.5,144 139.75,144 156.5,127.25 v156.5,68.75
  Bottom 0.6: EXTENTION2_MALE.7 MEMORY_8_FEMALE.12 156.67,68.58 | 139,68.5 139.5,68.5 EXTENTION2_MALE.7 | 8052_1_FEMALE.12 83.79,156.21 v84,156 | v113,144.5 v101.5,156 | BUFFER4.5 101.99,65.67 v101.95,65.7 | v101.25,45.25 v107.75,45.25 | EXTENTION2_MALE.7 139.08,68.58 v136.75,66.25 | MEMORY_F_FEMALE.12 156.67,68.58 | 156.67,68.58 v156.5,68.75
A_B2  (via drill 0.6 pad 1.7)
  Top 0.6: v99.25,65.75 99.25,43.75 v101.25,41.75 | v112.25,41.75 123,52.5 v130,52.5 | v82.75,158.75 97.75,158.75 103,164 v121.5,164 | v128.5,157 159.75,125.75 159.75,73.02 159.73,73 159.73,71.14 v159.75,71.12
  Bottom 0.6: v159.75,71.12 MEMORY_8_FEMALE.11 EXTENTION2_MALE.6 139.5,71 139,71 135,67 135,63.25 133.25,61.5 133.25,55.75 v130,52.5 | v159.75,71.12 MEMORY_F_FEMALE.11 | 99.25,65 v99.25,65.75 99.25,64.87 100.3,63.82 100.43,63.82 101,63.25 104.5,63.25 BUFFER4.6 | 159.75,71.25 v159.75,71.12 | 8052_1_FEMALE.11 v82.75,158.75 | v121.5,164 v128.5,157 | v101.25,41.75 v112.25,41.75
A_B3  (via drill 0.6 pad 1.7)
  Top 0.6: v92,66.75 91,66.75 87,62.75 85.5,62.75 84.5,63.75 84.5,65.25 103,83.75 115.75,83.75 v121.75,89.75
  Bottom 0.6: MEMORY_F_FEMALE.10 MEMORY_8_FEMALE.10 EXTENTION2_MALE.5 138.42,73.66 122.11,89.97 | 8052_1_FEMALE.10 82.71,161.29 85.75,158.25 85.75,155.52 122.12,119.15 122.12,115.86 122.11,115.85 122.11,89.97 | v92,66.75 97.75,61 97.75,55.75 104.5,55.75 BUFFER4.9 | v121.75,89.75 122,89.75 122.11,89.97
A_B4  (via drill 0.6 pad 1.7)
  Top 0.6: v118.25,55.75 128.25,55.75 v130,57.5 | v132.75,81.75 v130.25,79.25
  Bottom 0.6: 171.45,76.2 MEMORY_F_FEMALE.9 MEMORY_8_FEMALE.9 EXTENTION2_MALE.4 139.68,76.22 138.96,76.22 133.09,82.09 | 8052_1_FEMALE.9 84.53,163.83 87.33,161.03 87.33,156.33 124.57,119.09 124.57,90.61 133.09,82.09 | v118.25,55.75 112.25,55.75 BUFFER4.12 | v130,57.5 130.25,57.75 v130.25,79.25 | 133.09,82.09 v132.75,81.75
A_B5  (via drill 0.6 pad 1.7)
  Top 0.6: v117.25,63 118,63 121.75,59.25 130.75,59.25 v136.75,53.25 | v43.75,170.5 58,170.5 74.75,187.25 93,187.25 95.75,184.5 105.75,184.5 v110.33,179.92 | v131.25,157 137.5,150.75 161,150.75 167.31,144.44 v170.53,144.44
  Bottom 0.6: EXTENTION2_MALE.14 MEMORY_8_FEMALE.19 MEMORY_F_FEMALE.19 171.54,50.8 190.64,69.9 190.64,106.93 170.53,127.04 170.53,141.25 | IO_1_FEMALE.14 177.22,151.13 v170.53,144.44 170.53,141.25 | 139,51 139.5,51 EXTENTION2_MALE.14 | 112.25,63 BUFFER4.15 117.12,63.13 v117.25,63 | 26,170.5 25.96,170.54 | 25.96,170.54 18.25,178.25 18.25,179 12.75,179 8052_2_FEMALE.3 | 110.25,180 v110.33,179.92 131.25,159 v131.25,157 | 170.5,141.25 170.53,141.25 | 25.96,170.54 43.71,170.54 v43.75,170.5 | v136.75,53.25 137.25,53.25 137.38,53.12 137.38,52.69 138.29,51.78 138.72,51.78 EXTENTION2_MALE.14
A_B6  (via drill 0.6 pad 1.7, 0.8 pad 1.7)
  Top 0.6: v116.5,65.5 117.25,65.5 122.25,60.5 v135,60.5 | v17.5,176.5 58.5,176.5 70.54,188.54 v70.71,188.54
  Bottom 0.6: 112.25,65.5 BUFFER4.16 112.3,65.5 v116.5,65.5 | 12.75,176.5 8052_2_FEMALE.4 17.47,176.53 v17.5,176.5 | v70.71,188.54 70.8,188.46 70.83,188.46 70.83,188.83 71,189 191.75,189 191.75,150.5 189.75,148.5 189.5,148.5 IO_1_FEMALE.15 178.13,148.59 172.58,143.04 172.58,127.22 192.13,107.68 192.13,68.97 171.28,48.12 171.09,48.12 170.95,48.26 MEMORY_F_FEMALE.20 MEMORY_8_FEMALE.20 EXTENTION2_MALE.15 139.5,48.5 139,48.5 135,52.5 v135,60.5
A_B7  (via drill 0.6 pad 1.7, 0.8 pad 1.7)
  Top 0.6: v20,174 58.5,174 73.5,189 140.5,189 166.37,163.13 166.37,159.13 v179.75,145.75 | v120,47 v136.75,47 | v114.85,72.92 119.39,68.38 v119.39,68.24
  Bottom 0.6: IO_1_FEMALE.16 180.33,146.05 179.89,145.61 | 179.89,145.61 174.91,140.63 174.91,127.78 193.99,108.7 193.99,68.04 171.65,45.7 170.2,45.7 MEMORY_F_FEMALE.21 MEMORY_8_FEMALE.21 EXTENTION2_MALE.16 139.5,45.75 139,45.75 137.75,47 v136.75,47 | v120,47 120,67 119.25,67.75 119.25,68.1 v119.39,68.24 | 112.25,73.25 BUFFER4.19 114.48,73.29 v114.85,72.92 | 12.75,174 8052_2_FEMALE.5 v19.99,173.99 v20,174 | v179.75,145.75 179.89,145.61
A_B8  (via drill 0.6 pad 1.7, 0.8 pad 1.7)
  Top 0.6: 71.5,125.75 61,125.75 v15.75,171 | 71.5,125.75 v74.25,125.75 | v154.75,44 154.75,127.25 139.25,142.75 107,142.75 v98.75,134.5 | v83.25,137.75 71.5,126 71.5,125.75
  Bottom 0.6: EXTENTION2_MALE.17 MEMORY_8_FEMALE.22 154.79,43.18 | 154.79,43.18 MEMORY_F_FEMALE.22 | BUFFER2.18 81.25,105.75 78.5,105.75 78.5,121.5 v74.25,125.75 | 8052_2_FEMALE.6 15.3,171.45 v15.75,171 | v83.25,137.75 95.5,137.75 v98.75,134.5 | 154.79,43.18 154.75,43.22 v154.75,44
A_B9  (via drill 0.6 pad 1.7, 0.8 pad 1.7)
  Top 0.6: v61.75,114 41,114 33.38,121.62 | 33.38,121.62 9.75,145.25 v9.75,166.5 | v158.75,5.5 v158.75,40 | 33.38,121.62 6,94.25 6,63.5 63,6.5 v63,2
  Bottom 0.6: MEMORY_F_FEMALE.23 158.77,40.64 | 158.77,40.64 MEMORY_8_FEMALE.23 EXTENTION2_MALE.18 | 76,111.25 75.91,111.34 | 75.91,111.34 73.25,114 v61.75,114 | 12,168.75 12.5,168.75 8052_2_FEMALE.7 12.16,168.91 v9.75,166.5 | BUFFER2.16 81.25,100.75 81.12,100.62 79.09,100.62 75.91,103.8 75.91,111.34 | v63,2 154.5,2 158,5.5 v158.75,5.5 | 158.77,40.64 158.75,40.62 v158.75,40
A_B10  (via drill 0.6 pad 1.7, 0.8 pad 1.7)
  Top 0.6: v15.75,166 17.5,164.25 17.5,163.5 45.5,135.5 49.5,135.5 63.25,121.75 67.5,121.75 v70,119.25 | v153,38.75 153,97.5 142.75,107.75 v120.25,107.75 | v83,120.75 86.25,124 101.25,124 103.75,121.5 107.75,121.5 v109.5,119.75 | v78.5,104 v78.5,98.97
  Bottom 0.6: EXTENTION2_MALE.19 MEMORY_8_FEMALE.24 152.88,38.1 | 152.88,38.1 MEMORY_F_FEMALE.24 | 78.5,99 v78.5,98.97 78.5,97.25 80.28,95.47 BUFFER2.14 | v78.5,104 77.25,105.25 77.25,112 v70,119.25 | 12.75,166 12.75,166.25 8052_2_FEMALE.8 15.38,166.37 v15.75,166 | 81.25,95.5 BUFFER2.14 | BUFFER2.14 81.5,95.5 83.5,97.5 83.5,120.25 v83,120.75 | v109.5,119.75 120.25,109 v120.25,107.75 | 152.88,38.1 152.88,38.62 v153,38.75
A_B11  (via drill 0.6 pad 1.7)
  Top 0.6: v81.5,124.75 75.75,124.75 74.5,123.5 v64,123.5 | v61.5,121 58.25,121 15.85,163.4 | 146.25,36.25 v146.25,36.45 146.25,99.25 140.25,105.25 v120.46,105.25 120.25,105.25 | v107,119.75 106.25,119.75 105.75,120.25 103.25,120.25 100.75,122.75 87.5,122.75 v86.25,121.5 | v15.85,163.35 15.85,163.4 | 15.85,163.4 15.75,163.5
  Bottom 0.6: MEMORY_F_FEMALE.25 MEMORY_8_FEMALE.25 146.06,35.56 | EXTENTION2_MALE.20 146.06,35.56 | 12.75,163.5 12.75,163.75 8052_2_FEMALE.9 13.18,163.35 v15.85,163.35 | BUFFER2.12 81.5,90.5 84,90.5 84,96.25 84.75,97 84.75,118.78 86.25,120.28 v86.25,121.5 83,124.75 v81.5,124.75 | v107,119.75 107,118.5 120.25,105.25 v120.46,105.25 | v61.5,121 v64,123.5 | 146.06,35.56 146.06,36.26 v146.25,36.45
A_B12
  Bottom 0.6: BUFFER3.18 109.22,105.41 116.84,97.79 116.84,91.44 128.27,80.01 128.27,44.02 138.29,34 138.72,34 EXTENTION2_MALE.21 MEMORY_8_FEMALE.26 MEMORY_F_FEMALE.26 170.5,33.55 171.6,33.55 195.8,57.75 195.8,187 190.85,191.95 67.65,191.95 37.4,161.7 13.2,161.7 8052_2_FEMALE.10
A_B13  (via drill 0.6 pad 1.7)
  Top 0.6: v18,158.75 18.75,158.75 58.25,119.25 v67.5,119.25 | v89.25,121 97.5,121 100.75,117.75 104.75,117.75 110.25,112.25 v110.25,101.75
  Bottom 0.6: MEMORY_F_FEMALE.27 MEMORY_8_FEMALE.27 EXTENTION2_MALE.22 138.72,31.46 138.29,31.46 125.73,44.02 125.73,80.01 114.3,91.44 114.3,93.98 108.32,99.96 | 108.32,99.96 107.95,100.33 BUFFER3.16 | v67.5,119.25 72.5,124.25 72.5,126.5 73.5,127.5 87.67,127.5 89.43,125.73 89.43,121.18 v89.25,121 | 8052_2_FEMALE.11 v18,158.75 | 108.32,99.96 110.12,101.75 v110.25,101.75
A_B14
  Bottom 0.6: BUFFER3.14 107.95,95.25 124.46,78.74 124.46,42.75 138.29,28.92 138.72,28.92 EXTENTION2_MALE.23 MEMORY_8_FEMALE.28 MEMORY_F_FEMALE.28 170.5,27.5 171.6,27.5 172.7,26.4 172.7,22 154,3.3 64.35,3.3 1.65,66 1.65,145.75 12.1,156.2 12.65,156.2 8052_2_FEMALE.12
A_B15  (via drill 0.6 pad 1.7)
  Top 0.6: v41.75,153.5 43,153.5 v60.25,136.25
  Bottom 0.6: EXTENTION2_MALE.24 138.72,26.38 138.29,26.38 137.38,27.29 137.38,27.72 121.92,43.18 121.92,77.47 109.22,90.17 BUFFER3.12 105.25,90 103.25,92 103.25,122.5 94.25,131.5 94.25,136 82,136 80.5,134.5 80.5,132 76.5,132 73,135.5 73,136.25 v60.25,136.25 | 12.75,153.5 8052_2_FEMALE.13 41.58,153.67 v41.75,153.5
A_B16  (via drill 0.6 pad 1.7)
  Top 0.6: v83.5,44 86.75,47.25 90.25,47.25 97.5,40 v97.5,23 | v87,18 v92.75,18 96.5,14.25 129.25,14.25 136.75,21.75 v136.75,24.75
  Bottom 0.6: IC2.1 84.75,16.75 84.75,18 v87,18 | 139.5,23 EXTENTION2_MALE.25 138.89,22.86 137,24.75 v136.75,24.75 | v92.75,18 97.5,22.75 v97.5,23 | BUFFER.2 82.68,43.18 v83.5,44
A_B17
  Bottom 0.6: 84.15,21.45 82.5,19.8 82.5,17.05 IC2.2 | 84.15,21.45 84.15,32.45 80.85,35.75 BUFFER.5 | 84.15,21.45 85.8,19.8 90.2,19.8 100.1,29.7 129.25,29.7 138.6,20.35 139.7,20.35 EXTENTION2_MALE.26
A_B18
  Bottom 0.6: BUFFER.6 80.85,33.55 83.05,31.35 83.05,22 79.75,18.7 79.75,17.05 IC2.3 79.2,16.5 81.4,14.3 86.35,14.3 100.65,28.6 128.7,28.6 130.9,26.4 130.9,25.85 138.6,18.15 139.7,18.15 EXTENTION2_MALE.27
A_B19  (via drill 0.6 pad 1.7)
  Top 0.6: v134.25,15 126.25,7 89.75,7 83,13.75 v74.25,13.75
  Bottom 0.6: IC2.6 72.05,17.05 80.3,25.3 BUFFER.9 | 71.5,16.5 IC2.6 | 72,16 72,16.25 IC2.6 | 139.5,15 EXTENTION2_MALE.28 134.49,15.24 v134.25,15 | IC2.6 71.86,16.14 v74.25,13.75
AD0  (via drill 0.6 pad 1.7)
  Top 0.6: v62.75,54 83.25,54 95,65.75 v95,70 | v54,52.5 35.25,52.5 32.5,55.25 32.5,64 v41.75,73.25
  Bottom 0.6: IC1.2 41.72,85.28 41.72,85.09 42.58,84.24 42.76,84.24 44.45,82.55 8088_JUM_LEFT_MALE.16 8088.16 44.25,76 44.25,75.75 v41.75,73.25 | v95,70 102.5,70 103,70.5 104.5,70.5 BUFFER4.3 | v54,52.5 61.37,52.5 62.75,53.88 v62.75,54
AD1
  Bottom 0.6: IC1.3 44.26,85.28 44.26,85.09 45.12,84.24 45.3,84.24 46.99,82.55 8088_JUM_LEFT_MALE.15 8088.15 46.99,73.66 54.44,66.21 88.44,66.21 95.42,59.23 95.42,50.34 98.6,47.16 103.33,47.16 107.78,51.61 107.78,65.13 105.78,67.13 105.59,67.13 BUFFER4.4
AD2
  Bottom 0.6: IC1.4 46.8,85.28 46.8,85.09 47.66,84.24 47.84,84.24 49.53,82.55 8088_JUM_LEFT_MALE.14 8088.14 49.53,74.93 57.15,67.31 88.9,67.31 96.52,59.69 96.52,50.8 99.06,48.26 102.87,48.26 106.68,52.07 106.68,58.61 105.78,59.51 105.59,59.51 BUFFER4.7
AD3
  Bottom 0.6: IC1.5 49.34,85.28 49.34,85.09 50.2,84.24 50.38,84.24 52.07,82.55 8088_JUM_LEFT_MALE.13 8088.13 53.15,75.12 53.15,74.94 59.5,68.58 93.98,68.58 102.39,60.17 102.39,59.98 103.25,59.13 103.43,59.13 BUFFER4.8
AD4
  Bottom 0.6: IC1.6 51.88,85.28 51.88,85 54.61,82.26 8088_JUM_LEFT_MALE.12 8088.12 54.61,76.01 59.5,71.12 88.9,71.12 96.52,78.74 105.41,78.74 108.91,75.24 108.91,61.08 110.87,59.13 111.05,59.13 BUFFER4.13
AD5
  Bottom 0.6: BUFFER4.14 111.76,60.96 | 111.76,60.96 | 111.76,60.96 111.05,61.67 110.87,61.67 110.01,62.52 110.01,76.68 106.68,80.01 95.25,80.01 87.8,72.56 86.36,72.56 | 86.36,72.56 85.9,72.56 | 86.36,72.56 86.19,72.39 60.77,72.39 58.23,74.94 58.23,75.12 8088.11 8088_JUM_LEFT_MALE.11 57.15,81.28 53.34,85.09 53.35,85.25 IC1.7
AD6  (via drill 0.6 pad 1.7)
  Top 0.6: v108.5,88.25 108.5,111.75 105.25,115 v76.75,115 | v74.25,117.5 67.75,117.5 50.75,100.5 v39.25,100.5
  Bottom 0.6: 8088.10 8088_JUM_LEFT_MALE.10 59.69,82.26 56.96,85 56.96,85.28 IC1.8 55.75,86.5 55.75,88.5 40.75,88.5 36.25,93 36.25,97.82 38.93,100.5 v39.25,100.5 | BUFFER4.17 112.25,68.25 117.5,68.25 117.5,70 117.75,70.25 117.75,79 v108.5,88.25 | v74.25,117.5 v76.75,115
AD7  (via drill 0.6 pad 1.7)
  Top 0.6: 80.19,83.19 80,83 | 80.19,83.19 83.75,86.75 83.75,92 85,93.25 86.5,93.25 94.25,85.5 v106,85.5 | 80.19,83.19 62.32,83.19 v61.85,83.66
  Bottom 0.6: 8088.9 8088_JUM_LEFT_MALE.9 62.23,81.28 61.13,82.38 | 61.13,82.38 58.42,85.09 IC1.9 | v106,85.5 116.5,75 116.5,70.5 112.25,70.5 BUFFER4.18 | v61.85,83.66 61.85,83.1 61.13,82.38
AEN1
  Bottom 0.6: 8284_LEFT_MALE.3 CLK-GEN.3 | CLK-GEN.3
AEN2
  Bottom 0.6: 8284_LEFT_MALE.7 CLK-GEN.7
ALE  (via drill 0.6 pad 1.7)
  Top 0.6: v50.5,49.75 79,21.25 82.25,21.25 85.5,24.5 v85.5,33.43 85.5,33.75
  Bottom 0.6: 8088_JUM_RIGHT_MALE3.6 8088.25 | BUFFER4.11 112.25,52.75 114,51 114.42,51 116.65,48.77 116.48,48.6 116.48,37.17 111.3,32 100.75,32 91.75,23 88.5,23 BUFFER.11 88.25,22.75 86.25,24.75 86.25,33 85.82,33.43 v85.5,33.43 | 44.5,57 8088_JUM_RIGHT_MALE3.6 | 8088_JUM_RIGHT_MALE3.6 44.45,55.59 50.29,49.75 v50.5,49.75
ASYNC
  Bottom 0.6: MALE.4 | MALE.4 CLK-GEN.15
CE80000H
  Bottom 0.6: MEMORY_8_FEMALE.29 147.32,25.4 143.51,21.59 143.51,13.97 142.24,12.7 EXTENTION2_MALE.29 139.7,13.2 125.95,13.2 123.2,15.95 BUFFER5.18 123.2,17.05 121.55,18.7 104.5,18.7 91.3,5.5 65.45,5.5 3.85,67.1 3.85,92.95 15.4,104.5 15.4,149.05 13.75,150.7 13.2,150.7 8052_2_FEMALE.14
CEF0000H
  Bottom 0.6: MEMORY_F_FEMALE.29 158.75,25.4 154.94,21.59 154.94,20.32 144.78,10.16 EXTENTION2_MALE.30 139.7,10.45 123.75,10.45 118.25,15.95 | 118.25,15.95 118.25,16.5 BUFFER5.16 118.25,15.95 | 118.25,15.95 106.7,4.4 64.9,4.4 2.75,66.55 2.75,139.15 12.1,148.5 12.65,148.5 8052_2_FEMALE.15
CLK
  Bottom 0.6: 8088.19 8088_JUM_LEFT_MALE.19 35.85,80.99 35.85,81.42 34.94,82.33 25.53,82.33 25.29,82.09 CLK-GEN.8 | 8284_LEFT_MALE.8 CLK-GEN.8 | CLK-GEN.8
CSYNC
  Bottom 0.6: CLK-GEN.1 8284_LEFT_MALE.1 | 8284_LEFT_MALE.1
D_B0  (via drill 0.6 pad 1.7)
  Top 0.6: v83.5,171.5 93.5,171.5 98.5,176.5 115.5,176.5 119.25,172.75 151.5,172.75 157.15,167.1 v157.15,166.98
  Bottom 0.6: EXTENTION2_MALE.1 MEMORY_8_FEMALE.6 MEMORY_F_FEMALE.6 172.83,83.82 178.63,89.62 178.63,102.65 157.13,124.16 157.13,167 | IC1.18 43.45,94.05 43.45,160.6 53.9,171.05 76.96,171.05 8052_1_FEMALE.6 | IO_1_FEMALE.6 189.21,171.43 161.5,171.43 157.13,167.06 157.13,167 | 77.75,171.5 8052_1_FEMALE.6 | 157.13,167 157.25,167 157.23,166.98 v157.15,166.98 | 8052_1_FEMALE.6 83.45,171.45 v83.5,171.5
D_B1
  Bottom 0.6: IC1.17 45.72,161.29 53.34,168.91 8052_1_FEMALE.7 77.5,168.75 77.75,168.75 77.89,168.57 86.84,168.57 89.26,166.15 89.26,157.45 126.75,119.96 126.75,92.89 138.37,81.28 EXTENTION2_MALE.2 MEMORY_8_FEMALE.7 MEMORY_F_FEMALE.7 171.62,81.28 171.74,81.16 171.93,81.16 180.21,89.44 180.21,103.11 158.8,124.52 158.8,165.01 162.71,168.91 IO_1_FEMALE.7
D_B2  (via drill 0.6 pad 1.7)
  Top 0.6: v86.5,166.5 88.5,166.5 90.25,168.25 100.25,168.25 101.25,167.25 141.5,167.25 141.75,167.5 152.5,167.5 157.75,162.25 161.07,162.25 v161.09,162.27
  Bottom 0.6: EXTENTION2_MALE.3 MEMORY_8_FEMALE.8 MEMORY_F_FEMALE.8 171.93,78.74 171.93,78.73 181.7,88.51 181.7,103.67 160.39,124.99 160.39,161.56 v161.09,162.27 165.19,166.37 IO_1_FEMALE.8 | 8052_1_FEMALE.8 57.15,166.37 48.26,157.48 IC1.16 | 77.75,166.5 8052_1_FEMALE.8 | 8052_1_FEMALE.8 77.6,166.5 v86.5,166.5
D_B3  (via drill 0.6 pad 1.7, 0.8 pad 1.7)
  Top 0.6: v26.75,172.25 44.12,154.88 | 44.12,154.88 75.25,186 85.25,186 89,182.25 v89,174.5 | v135.5,155.25 161.5,155.25 v168.75,148 | 44.12,154.88 v50,149
  Bottom 0.6: EXTENTION2_MALE.13 MEMORY_8_FEMALE.18 MEMORY_F_FEMALE.18 171.73,53.34 171.74,53.33 189.06,70.64 189.06,106.37 168.67,126.76 168.67,147.7 168.86,147.89 | IO_1_FEMALE.13 174.64,153.67 168.86,147.89 | v50,149 50,94.75 50.75,94 IC1.15 | 8052_2_FEMALE.2 12.75,181.5 12.75,181.25 17.75,181.25 v26.75,172.25 | v89,174.5 108.25,155.25 v135.5,155.25 | v168.75,148 168.86,147.89
D_B4  (via drill 0.6 pad 1.7, 0.8 pad 1.7)
  Top 0.6: v176,157 141,192 69,192 60,183 15.75,183 v15.75,182.9 15.75,175.75 v52.5,139
  Bottom 0.6: EXTENTION2_MALE.12 MEMORY_8_FEMALE.17 MEMORY_F_FEMALE.17 170.31,55.75 171.74,55.75 187.66,71.67 187.66,105.72 166.9,126.48 166.9,151.42 171.69,156.21 176,156.21 | 176,156.21 IO_1_FEMALE.12 | v52.5,139 52.5,94.75 53.25,94 IC1.14 | 8052_2_FEMALE.1 12.75,184 13.5,184 14.5,183 15.65,183 v15.75,182.9 | 176,156.21 v176,157
D_B5  (via drill 0.6 pad 1.7)
  Top 0.6: v68.5,189 70.25,190.75 140.5,190.75 169,162.25 v169,159 | 74.5,182.75 v74.5,182.42 74.5,145.5 76.75,143.25 v77.5,143.75 66.5,132.75 v56.5,132.75
  Bottom 0.6: MEMORY_F_FEMALE.16 MEMORY_8_FEMALE.16 EXTENTION2_MALE.11 | MEMORY_F_FEMALE.16 170.79,58.42 171,58.63 | MEMORY_F_FEMALE.16 171.77,58.42 171.93,58.26 186.08,72.41 186.08,105.35 165.23,126.2 165.23,155.05 168.93,158.75 | 168.93,158.75 IO_1_FEMALE.11 | v56.5,132.75 56.5,94.5 56,94 IC1.13 | 77.5,146 8052_1_FEMALE.16 77.47,143.78 v77.5,143.75 | 68.5,188.75 v68.5,189 68.5,188.42 v74.5,182.42 | v169,159 168.93,158.75
D_B6  (via drill 0.6 pad 1.7)
  Top 0.6: v102.75,136 128.75,136 v133.67,140.92 133.75,141 | v137.25,157 163.27,157 v163.55,157.28
  Bottom 0.6: IC1.12 58.42,114.4 | 58.42,114.4 58.42,138.43 68.58,148.59 75,148.59 | 75,148.59 8052_1_FEMALE.15 | 58.3,114.4 58.42,114.4 | 139.7,60.5 EXTENTION2_MALE.10 MEMORY_8_FEMALE.15 MEMORY_F_FEMALE.15 170.27,61.05 172.4,61.05 184.68,73.34 184.68,104.89 163.55,126.02 163.55,157 | IO_1_FEMALE.10 167.56,161.29 v163.55,157.28 163.55,157 | 75,148.59 75,143.75 77.02,141.73 97.02,141.73 v102.75,136 | 163.5,157 163.55,157 | v133.67,140.92 137.25,144.5 v137.25,157
D_B7  (via drill 0.6 pad 1.7)
  Top 0.6: v70.75,134.5 80,143.75 v80.46,143.75 92.5,143.75 v96.5,139.75 | v99,137.25 121.5,159.75 v162.25,159.75
  Bottom 0.6: EXTENTION2_MALE.9 MEMORY_8_FEMALE.14 MEMORY_F_FEMALE.14 172.46,63.5 172.58,63.38 183.29,74.08 183.29,104.33 161.78,125.83 161.78,159.7 162.04,159.96 | 162.04,159.96 165.91,163.83 IO_1_FEMALE.9 | IC1.11 60.75,94 60,94.75 60,117 70.75,127.75 v70.75,134.5 | 8052_1_FEMALE.14 77.5,151 78.25,151 80,149.25 80,144.21 v80.46,143.75 | v162.25,159.75 162.04,159.96 | v99,137.25 v96.5,139.75
DEN
  Bottom 0.6: 8088_JUM_RIGHT_MALE3.5 8088.26
DT/R
  Bottom 0.6: 8088_JUM_RIGHT_MALE3.4 8088.27 50.05,61.05 47.85,63.25 33.55,63.25 6.05,90.75 6.05,91.85 11,96.8 12.1,96.8 25.3,83.6 31.35,83.6 34.1,86.35 37.95,86.35 IC1.1
EFI
  Bottom 0.6: MALE.5 24.13,93.24 24.13,92.71 23.91,92.71 CLK-GEN.14
F/C
  Bottom 0.6: MALE.6 CLK-GEN.13 | CLK-GEN.13
GND  (via drill 0.6 pad 1.7)
  Top 0.6: v72,85.75 68.75,89 61.6,89 | 61.6,89 v60.93,89 37.5,89 32,83.5 32,76.2 | 103,48.25 103,22 v102.5,21.5 102.5,21.25 84,21.25 82,19.25 v77.25,19.25 v67.82,19.25 66.75,19.25 31.25,54.75 31.25,64.5 32,65.25 32,76.2 | 103,48.25 v103,51 | 103,48.25 103.25,48.25 106.75,51.75 106.75,73.75 110.5,77.5 113.75,77.5 131.75,95.5 v132.5,95.5 | v101.25,171 149.07,171 v149.39,170.68 | v86.69,81.65 86.69,85.81 v85.5,87 | 61.6,89.1 61.6,89 | v31.96,76.2 32,76.2
  Bottom 0.6: 8284_LEFT_MALE.9 CLK-GEN.9 | CLK-GEN.9 | CLK-GEN.9 29.65,76.2 v31.96,76.2 8088.20 8088_JUM_LEFT_MALE.20 34,80 32,80 32,80.5 | 8052_1_FEMALE.2 R1.1 85.09,177.8 96.52,177.8 ENABLE_BUFFERS.1 100.5,173.75 101.25,173 v101.25,171 | IO_1_FEMALE.2 C2.2 183.7,181.5 156.7,181.5 149.39,174.19 149.39,171 | 135.1,98.1 139.7,93.5 EXTENTION1_MALE.2 MEMORY_8_FEMALE.2 C1.2 MEMORY_F_FEMALE.2 170.5,94.05 171.05,94.05 172.7,95.7 172.7,98.84 149.39,122.15 v149.39,170.68 149.39,171 | 135.1,98.1 133.65,99.55 133.65,109.45 BUFFER1.10 | 84.6,87.9 87.45,90.75 87.45,103.4 96.25,112.2 99,112.2 100.1,111.1 100.1,89.65 97.9,87.45 BUFFER3.10 | 84.6,87.9 83.05,86.35 79.75,86.35 78.65,87.45 78.65,87.54 | 61,86.5 IC1.10 60.96,88.97 v60.93,89 | 84.6,87.9 v85.5,87 | 82.75,80.25 8088_JUM_LEFT_MALE.1 8088.1 86.69,80.34 v86.69,81.65 | 149.25,171 149.39,171 | v77.25,19.25 80.75,22.75 BUFFER.10 | IC2.8 67,16.75 67.75,17.5 67.75,19.18 v67.82,19.25 | 105.25,24 BUFFER5.10 102.78,21.5 v102.5,21.5 | 104.5,52.75 BUFFER4.10 104.51,52.51 v103,51 | v132.5,95.5 135.1,98.1 | 78.65,87.54 78.32,87.87 78.29,87.85 BUFFER2.10 | v72,85.75 76.86,85.75 78.65,87.54
HLDA
  Bottom 0.6: 8088_JUM_RIGHT_MALE3.1 8088.30
HOLD
  Bottom 0.6: HOLD.1 8088.31
HOLD_JUM  (via drill 0.6 pad 1.7)
  Top 0.6: 90.75,48.5 101.25,38 v101.25,26.75 | 90.75,48.5 80,48.5 79.5,48 v79.21,48 62.28,48 v56.13,54.15 36.14,54.15 35.79,54.5 v35.69,54.4 | v102,74.5 96.25,68.75 96.25,54.25 90.75,48.75 90.75,48.5 | 67.5,110.75 67.25,110.5 67,110.5 55,98.5 38.75,98.5 36.17,101.08 | 67.5,110.75 71,114.25 73.5,114.25 92,132.75 92.25,132.75 92.25,133 103.75,144.5 v103.75,146.41 v103.75,162.25 | v28.25,64.25 28.25,85.25 14,99.5 14,100.25 20,106.25 31,106.25 36.17,101.08 | 67.12,111.24 v67.12,111.14 67.12,111.17 | 67.12,111.17 | 67.12,111.17 67.5,110.8 67.5,110.75 | 36.17,101.08 39.05,103.95 v41.25,103.95
  Bottom 0.6: BUFFER.1 80.75,45.75 79.25,47.25 79.25,47.96 v79.21,48 | v101.25,26.75 101.25,27.5 125.25,27.5 127.25,25.5 127.25,25.25 128.25,24.25 BUFFER5.1 | 73.5,110.5 BUFFER2.1 67.55,110.71 v67.12,111.14 | BUFFER1.1 133.25,132.75 116.5,132.75 103.75,145.5 v103.75,146.41 | ENABLE_BUFFERS.2 103,173.75 103.75,173 v103.75,162.25 | v35.69,54.4 35.26,54.83 33.64,54.83 28.25,60.22 v28.25,64.25 | BUFFER4.1 103.33,75.83 v102,74.5 | IC1.19 40.66,94 40.66,96.81 42.02,98.17 42.02,99.31 42.35,99.64 42.35,102.44 41.69,103.1 41.69,103.51 v41.25,103.95 | 1-HOLD_JUMPER_MALE.1 59.23,54.15 v56.13,54.15
INTA
  Bottom 0.6: 8088_JUM_RIGHT_MALE3.7 8088.24
INTR
  Bottom 0.6: 8088.18 8088_JUM_LEFT_MALE.18
IO/M  (via drill 0.6 pad 1.7)
  Top 0.6: v136,131.75 141.25,137 v142.5,137 | v146.5,141.5 146.5,140.75 167.25,120 167.25,11.5 159.5,3.75 69,3.75 64.5,8.25 v64.5,17.5
  Bottom 0.6: 8088.28 8088_JUM_RIGHT_MALE3.3 52.25,57 52.25,29.75 v64.5,17.5 | 146.5,141 v146.5,141.5 142.5,137.5 v142.5,137 | BUFFER1.2 134.53,130.28 v136,131.75
IO/M_B  (via drill 0.6 pad 1.7)
  Top 0.6: v81.25,179 82,179 88.25,172.75 93,172.75 98.5,178.25 111,178.25 117,184.25 117,185.75 117.75,186.5 140.25,186.5 v152.69,174.06 | v88.75,13.25 96,13.25 96.25,13 129.75,13 133.5,16.75 135,16.75 137.25,14.5 137.25,8.75 137.75,8.25 142,8.25 157,23.25 157,59.25 163.25,65.5 v163.25,91.44 | v143.4,127.75 v151.75,127.75
  Bottom 0.6: v163.25,91.44 MEMORY_8_FEMALE.3 EXTENTION1_MALE.3 | v163.25,91.44 MEMORY_F_FEMALE.3 171.85,91.44 172.04,91.25 174.37,93.58 174.37,100.11 152,122.47 152,127.75 | IO_1_FEMALE.3 157.71,179.07 v152.69,174.06 | 152,127.75 152,173.37 v152.69,174.06 | IC2.5 74.5,16.5 76.75,16.5 IC2.4 77,16.25 80.25,13 88.75,13 v88.75,13.25 | BUFFER1.18 141,127.75 v143.4,127.75 143.75,127.75 | v151.75,127.75 152,127.75 | 77.5,179 8052_1_FEMALE.3 81.18,179.07 v81.25,179 | 152.5,174.25 v152.69,174.06 | 163.25,91.25 v163.25,91.44
MN/MX
  Bottom 0.6: 8088_JUM_RIGHT_MALE1.8 8088.33
N$1
  Bottom 0.6: JP1.4 JP1.3 JP1.2 JP1.1
N$2
  Bottom 0.6: JP2.4 JP2.3 JP2.2 JP2.1
N$3
  Bottom 0.6: R1.2 90.17,181.61 91.44,180.34 LED1.K
N$4
  Bottom 0.6: 8052_1_FEMALE.1 80.01,184.15 82.55,186.69 POWER_SWITCH.4
N$5
  Bottom 0.6: IC2.15 82.5,9.35 82.5,9.9 84.15,11.55 89.65,11.55 104.5,26.4 123.75,26.4 125.95,24.2 BUFFER5.2
N$6
  Bottom 0.6: IC2.7 69.3,16.5 69.3,14.3 64.9,9.9 64.9,7.7 66,6.6 90.75,6.6 106.15,22 118.8,22 120.45,23.65 BUFFER5.4
NMI
  Bottom 0.6: 8088.17 8088_JUM_LEFT_MALE.17
OSC
  Bottom 0.6: MALE.7 CLK-GEN.12 | CLK-GEN.12
PCLK
  Bottom 0.6: 8284_LEFT_MALE.2 CLK-GEN.2
RD  (via drill 0.6 pad 1.7)
  Top 0.6: v124,125.25 98,125.25 v97.5,125.75 | v78.25,63.75 88.5,74 88.5,89 87.5,90 87.25,90 v85.75,91.5
  Bottom 0.6: 8088_JUM_RIGHT_MALE1.9 8088.32 | v85.75,91.5 86,91.75 86,114.25 v97.5,125.75 | 62.25,61.25 8088.32 | BUFFER1.4 124.05,125.2 v124,125.25 | 8088.32 62.23,62.16 63.83,63.76 78.24,63.76 v78.25,63.75
RD_B  (via drill 0.6 pad 1.7)
  Top 0.6: v142.75,88.9 142.06,89.59 142.06,97.87 138.75,101.18 v138.75,101.25
  Bottom 0.6: v142.75,88.9 MEMORY_8_FEMALE.4 MEMORY_F_FEMALE.4 170.23,88.95 172.81,88.95 175.75,91.89 175.75,101.03 153.59,123.19 153.59,169.75 160.37,176.53 IO_1_FEMALE.4 | v142.75,88.9 EXTENTION1_MALE.4 | 139.7,123.2 140.8,123.2 BUFFER1.16 | 139.7,123.2 138.05,124.85 138.05,134.2 128.15,144.1 116.05,144.1 84.15,176 77.51,176 8052_1_FEMALE.4 | 139.7,123.2 138.75,122.25 v138.75,101.25 | 142.75,89 v142.75,88.9
RDY1
  Bottom 0.6: 8284_LEFT_MALE.4 CLK-GEN.4
RDY2
  Bottom 0.6: 8284_LEFT_MALE.6 CLK-GEN.6 | CLK-GEN.6
READY
  Bottom 0.6: 8088.22 8088_JUM_RIGHT_MALE3.9
READY_8284
  Bottom 0.6: 8284_LEFT_MALE.5 CLK-GEN.5 | CLK-GEN.5
RES
  Bottom 0.6: MALE.8 CLK-GEN.11 | CLK-GEN.11
RESET
  Bottom 0.6: 8088_JUM_RIGHT_MALE3.10 8088.21 34.1,61.05 4.95,90.2 4.95,92.4 10.45,97.9 15.4,97.9 28.05,85.25 30.8,85.25 CLK-GEN.10 MALE.9
SS0
  Bottom 0.6: 8088_JUM_RIGHT_MALE1.7 8088.34
TEST
  Bottom 0.6: 8088_JUM_RIGHT_MALE3.8 8088.23
WR  (via drill 0.6 pad 1.7)
  Top 0.6: v130.75,119.25 111.5,119.25 110.25,118 106.25,118 105.25,119 102,119 v101.5,119.5 | v92,95.75 v92,110.5 | v54.58,63.75 75.75,63.75 86.75,74.75 v86.75,76.5
  Bottom 0.6: 8088_JUM_RIGHT_MALE3.2 8088.29 54.61,63.72 v54.58,63.75 | v86.75,76.5 91.5,81.25 91.5,95.25 v92,95.75 | BUFFER1.6 131.62,120.12 v130.75,119.25 | v101.5,119.5 92.5,110.5 v92,110.5
WR_B  (via drill 0.6 pad 1.7)
  Top 0.6: v129.75,134.5 v129.75,121.5 | v143.71,98.17 145.04,96.84 145.04,86.9 v144.5,86.36
  Bottom 0.6: v144.5,86.36 EXTENTION1_MALE.5 139.5,86.5 139,86.5 129,96.5 129,120.75 v129.75,121.5 | v144.5,86.36 MEMORY_8_FEMALE.5 MEMORY_F_FEMALE.5 172.2,86.36 177.24,91.39 177.24,101.81 155.36,123.69 155.36,167.52 161.88,174.04 161.92,173.99 IO_1_FEMALE.5 | BUFFER1.14 141,117.5 143.25,117.5 143.25,98.63 v143.71,98.17 | 144.5,86.5 v144.5,86.36 | v129.75,134.5 120.5,134.5 99.75,155.25 99.75,157.75 84.75,172.75 84.75,173.75 77.5,173.75 8052_1_FEMALE.5
X1
  Bottom 0.6: Q1.2 24.75,104.63 MALE.2 CLK-GEN.17 | CLK-GEN.17
X2
  Bottom 0.6: Q1.1 28.16,104.45 MALE.3 CLK-GEN.16 | CLK-GEN.16

### Text on the board
tNames: + | red | 4-Header_female | 3-header-male | 16-Header_female | 16-Header_female | 16-Header_female | 4-Header_female | 9-Header_male | 20-header_male | 9-Header_male | 35-Header_male | 30-Header_female | 30-Header_female | 20-header_male